# EAGLE design plugwatch (EAGLE 8.4.0)
AUTHOR: Noah Klugman; REV: B; TITLE: PlugWatch

## Sheet 1 of 4: Headers
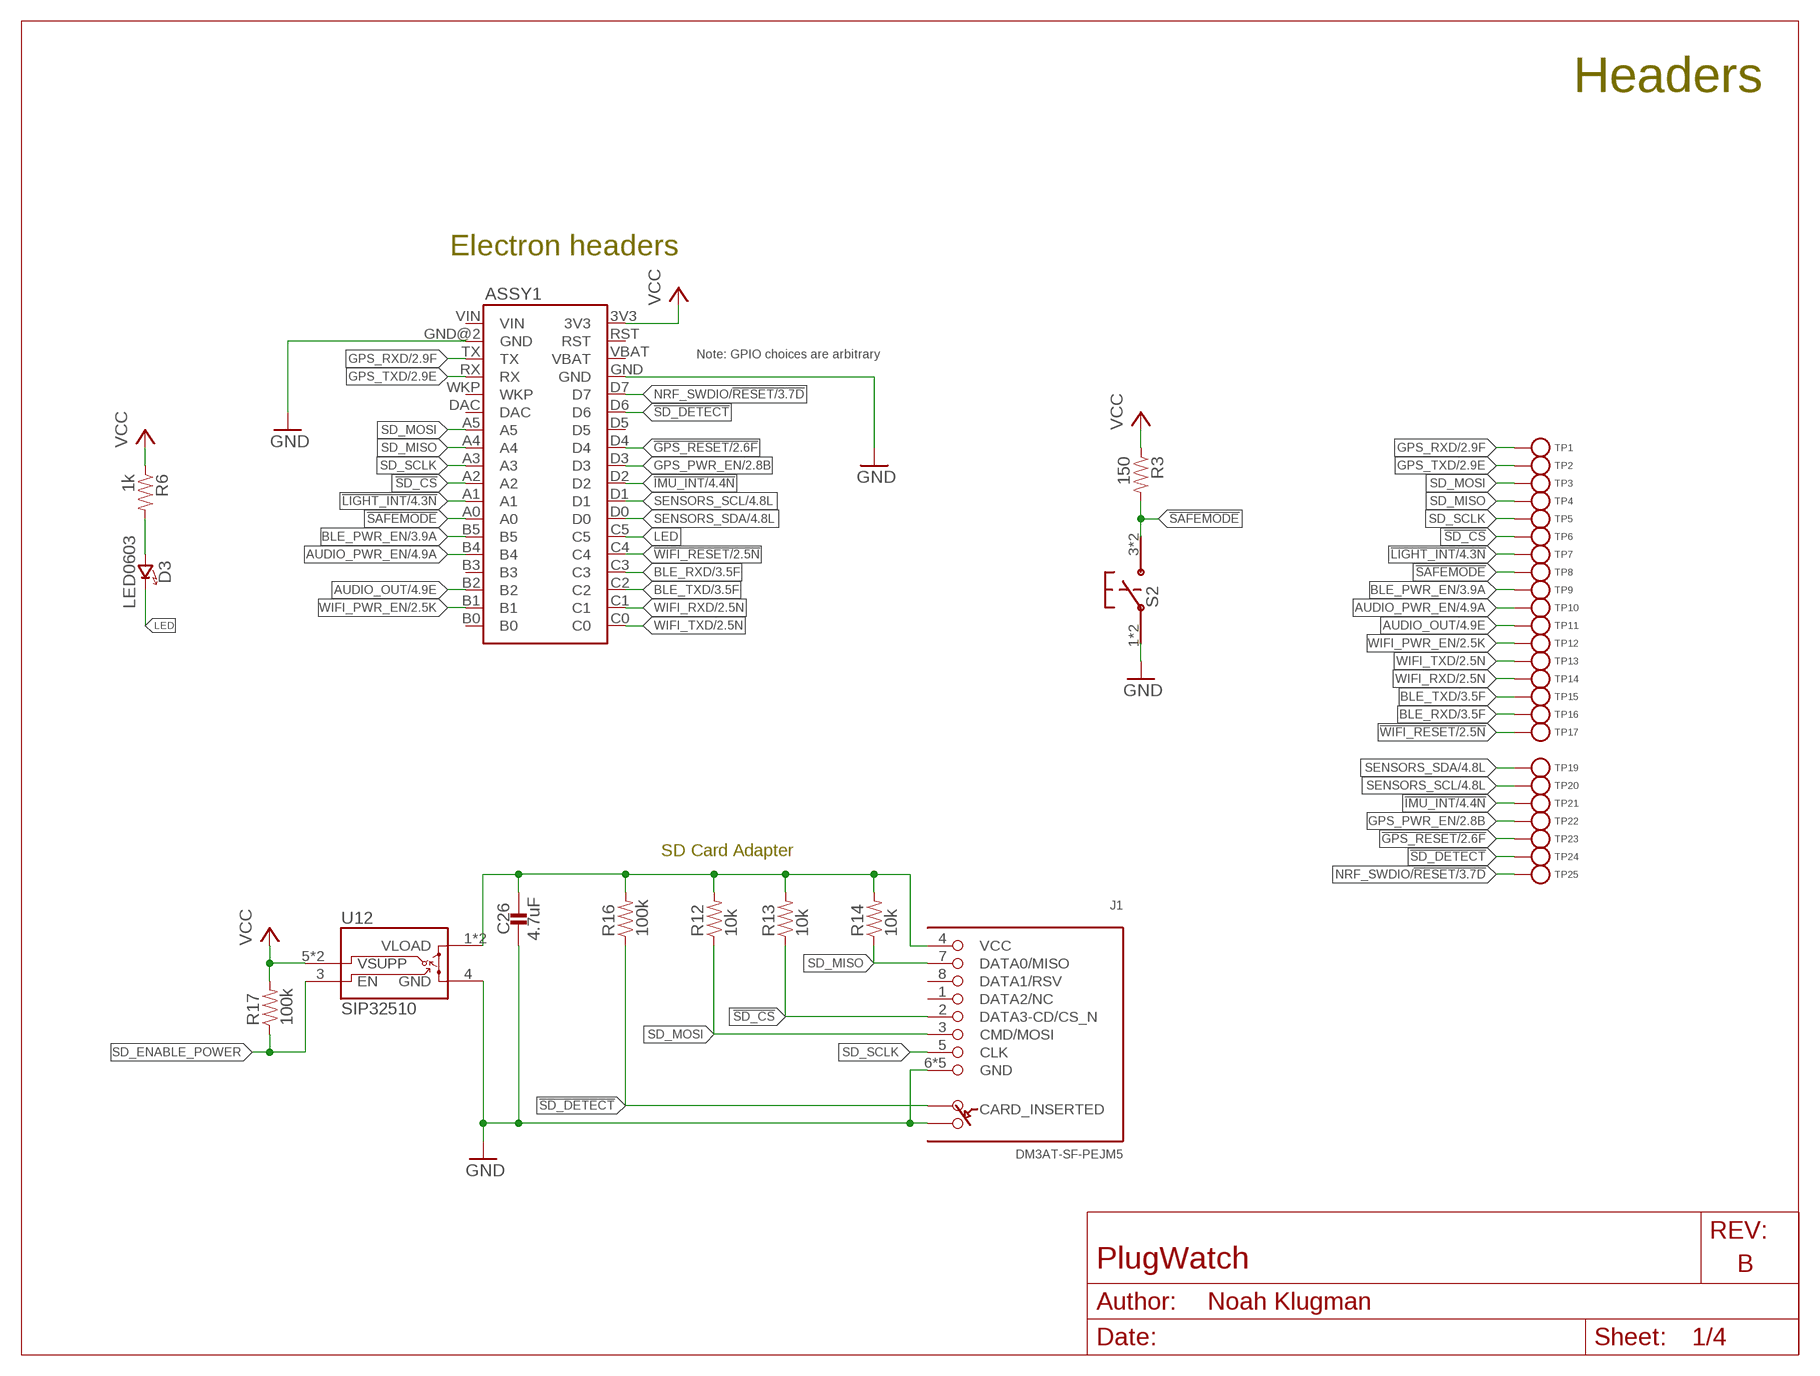
[diagram p0: schematic, sheet 1]

### Parts
ASSY1  ELECTRON  [ELECTRON_SINGLE-ROW]
C26  4.7uF  CAPACITOR0402_CAP  [0402_CAP]
D3  LED0603  [LED-0603]
J1  DM3AT-SF-PEJM5  [DM3AT-SF-PEJM5]
R3  150  RESISTOR0402_RES  [0402_RES]
R6  1k  RESISTOR0402_RES  [0402_RES]
R12  10k  RESISTOR0402_RES  [0402_RES]
R13  10k  RESISTOR0402_RES  [0402_RES]
R14  10k  RESISTOR0402_RES  [0402_RES]
R16  100k  RESISTOR0402_RES  [0402_RES]
R17  100k  RESISTOR0402_RES  [0402_RES]
S2  PTS645SM43SMTR92  [PTS645]
TP1  TEST_POINT_0.040IN  [TESTPOINT_0.040IN]
TP2  TEST_POINT_0.040IN  [TESTPOINT_0.040IN]
TP3  TEST_POINT_0.040IN  [TESTPOINT_0.040IN]
TP4  TEST_POINT_0.040IN  [TESTPOINT_0.040IN]
TP5  TEST_POINT_0.040IN  [TESTPOINT_0.040IN]
TP6  TEST_POINT_0.040IN  [TESTPOINT_0.040IN]
TP7  TEST_POINT_0.040IN  [TESTPOINT_0.040IN]
TP8  TEST_POINT_0.040IN  [TESTPOINT_0.040IN]
TP9  TEST_POINT_0.040IN  [TESTPOINT_0.040IN]
TP10  TEST_POINT_0.040IN  [TESTPOINT_0.040IN]
TP11  TEST_POINT_0.040IN  [TESTPOINT_0.040IN]
TP12  TEST_POINT_0.040IN  [TESTPOINT_0.040IN]
TP13  TEST_POINT_0.040IN  [TESTPOINT_0.040IN]
TP14  TEST_POINT_0.040IN  [TESTPOINT_0.040IN]
TP15  TEST_POINT_0.040IN  [TESTPOINT_0.040IN]
TP16  TEST_POINT_0.040IN  [TESTPOINT_0.040IN]
TP17  TEST_POINT_0.040IN  [TESTPOINT_0.040IN]
TP19  TEST_POINT_0.040IN  [TESTPOINT_0.040IN]
TP20  TEST_POINT_0.040IN  [TESTPOINT_0.040IN]
TP21  TEST_POINT_0.040IN  [TESTPOINT_0.040IN]
TP22  TEST_POINT_0.040IN  [TESTPOINT_0.040IN]
TP23  TEST_POINT_0.040IN  [TESTPOINT_0.040IN]
TP24  TEST_POINT_0.040IN  [TESTPOINT_0.040IN]
TP25  TEST_POINT_0.040IN  [TESTPOINT_0.040IN]
U12  SIP32510  [TSOT23-6]

### Nets
!GPS_RESET: ASSY1.D4 TP23.TESTPOINT ; also sheet 2
!IMU_INT: ASSY1.D2 TP21.TESTPOINT ; also sheet 4
!LIGHT_INT: ASSY1.A1 TP7.TESTPOINT ; also sheet 4
!SAFEMODE: ASSY1.A0 R3.2 S2.3 S2.4 TP8.TESTPOINT
!SD_CS: ASSY1.A2 J1.2(DATA3-CD/CS_N) R13.1 TP6.TESTPOINT
!SD_DETECT: ASSY1.D6 J1.A R16.1 TP24.TESTPOINT
!WIFI_RESET: ASSY1.C4 TP17.TESTPOINT ; also sheet 2
AUDIO_OUT: ASSY1.B2 TP11.TESTPOINT ; also sheet 4
AUDIO_PWR_EN: ASSY1.B4 TP10.TESTPOINT ; also sheet 4
BLE_PWR_EN: ASSY1.B5 TP9.TESTPOINT ; also sheet 3
BLE_RXD: ASSY1.C3 TP16.TESTPOINT ; also sheet 3
BLE_TXD: ASSY1.C2 TP15.TESTPOINT ; also sheet 3
GND: ASSY1.GND ASSY1.GND@2(GND) C26.2 J1.6(GND) J1.B J1.MOUNT0(GND) J1.MOUNT1(GND) J1.MOUNT2(GND) J1.MOUNT3(GND) S2.1 S2.2 U12.4(GND) ; also sheet 2,3,4
GPS_PWR_EN: ASSY1.D3 TP22.TESTPOINT ; also sheet 2
GPS_RXD: ASSY1.TX TP1.TESTPOINT ; also sheet 2
GPS_TXD: ASSY1.RX TP2.TESTPOINT ; also sheet 2
LED: ASSY1.C5 D3.C(CATHODE)
N$3: D3.A(ANODE) R6.2
N$18: C26.1 J1.4(VCC) R12.2 R13.2 R14.2 R16.2 U12.1(VLOAD) U12.2(VLOAD)
NRF_SWDIO/!RESET: ASSY1.D7 TP25.TESTPOINT ; also sheet 3
SD_ENABLE_POWER: R17.1 U12.3(EN)
SD_MISO: ASSY1.A4 J1.7(DATA0/MISO) R14.1 TP4.TESTPOINT
SD_MOSI: ASSY1.A5 J1.3(CMD/MOSI) R12.1 TP3.TESTPOINT
SD_SCLK: ASSY1.A3 J1.5(CLK) TP5.TESTPOINT
SENSORS_SCL: ASSY1.D1 TP20.TESTPOINT ; also sheet 4
SENSORS_SDA: ASSY1.D0 TP19.TESTPOINT ; also sheet 4
VCC: ASSY1.3V3 R3.1 R6.1 R17.2 U12.5(VSUPP) U12.6(VSUPP) ; also sheet 2,3,4
WIFI_PWR_EN: ASSY1.B1 TP12.TESTPOINT ; also sheet 2
WIFI_RXD: ASSY1.C1 TP14.TESTPOINT ; also sheet 2
WIFI_TXD: ASSY1.C0 TP13.TESTPOINT ; also sheet 2
Unconnected: ASSY1.B0 ASSY1.B3 ASSY1.D5 ASSY1.DAC ASSY1.RST ASSY1.VBAT ASSY1.WKP J1.1(DATA2/NC) J1.8(DATA1/RSV)

### Notes on the sheet
- Headers
- Electron headers
- Note: GPIO choices are arbitrary
- SD Card Adapter

## Sheet 2 of 4: GPS and WiFi Radios
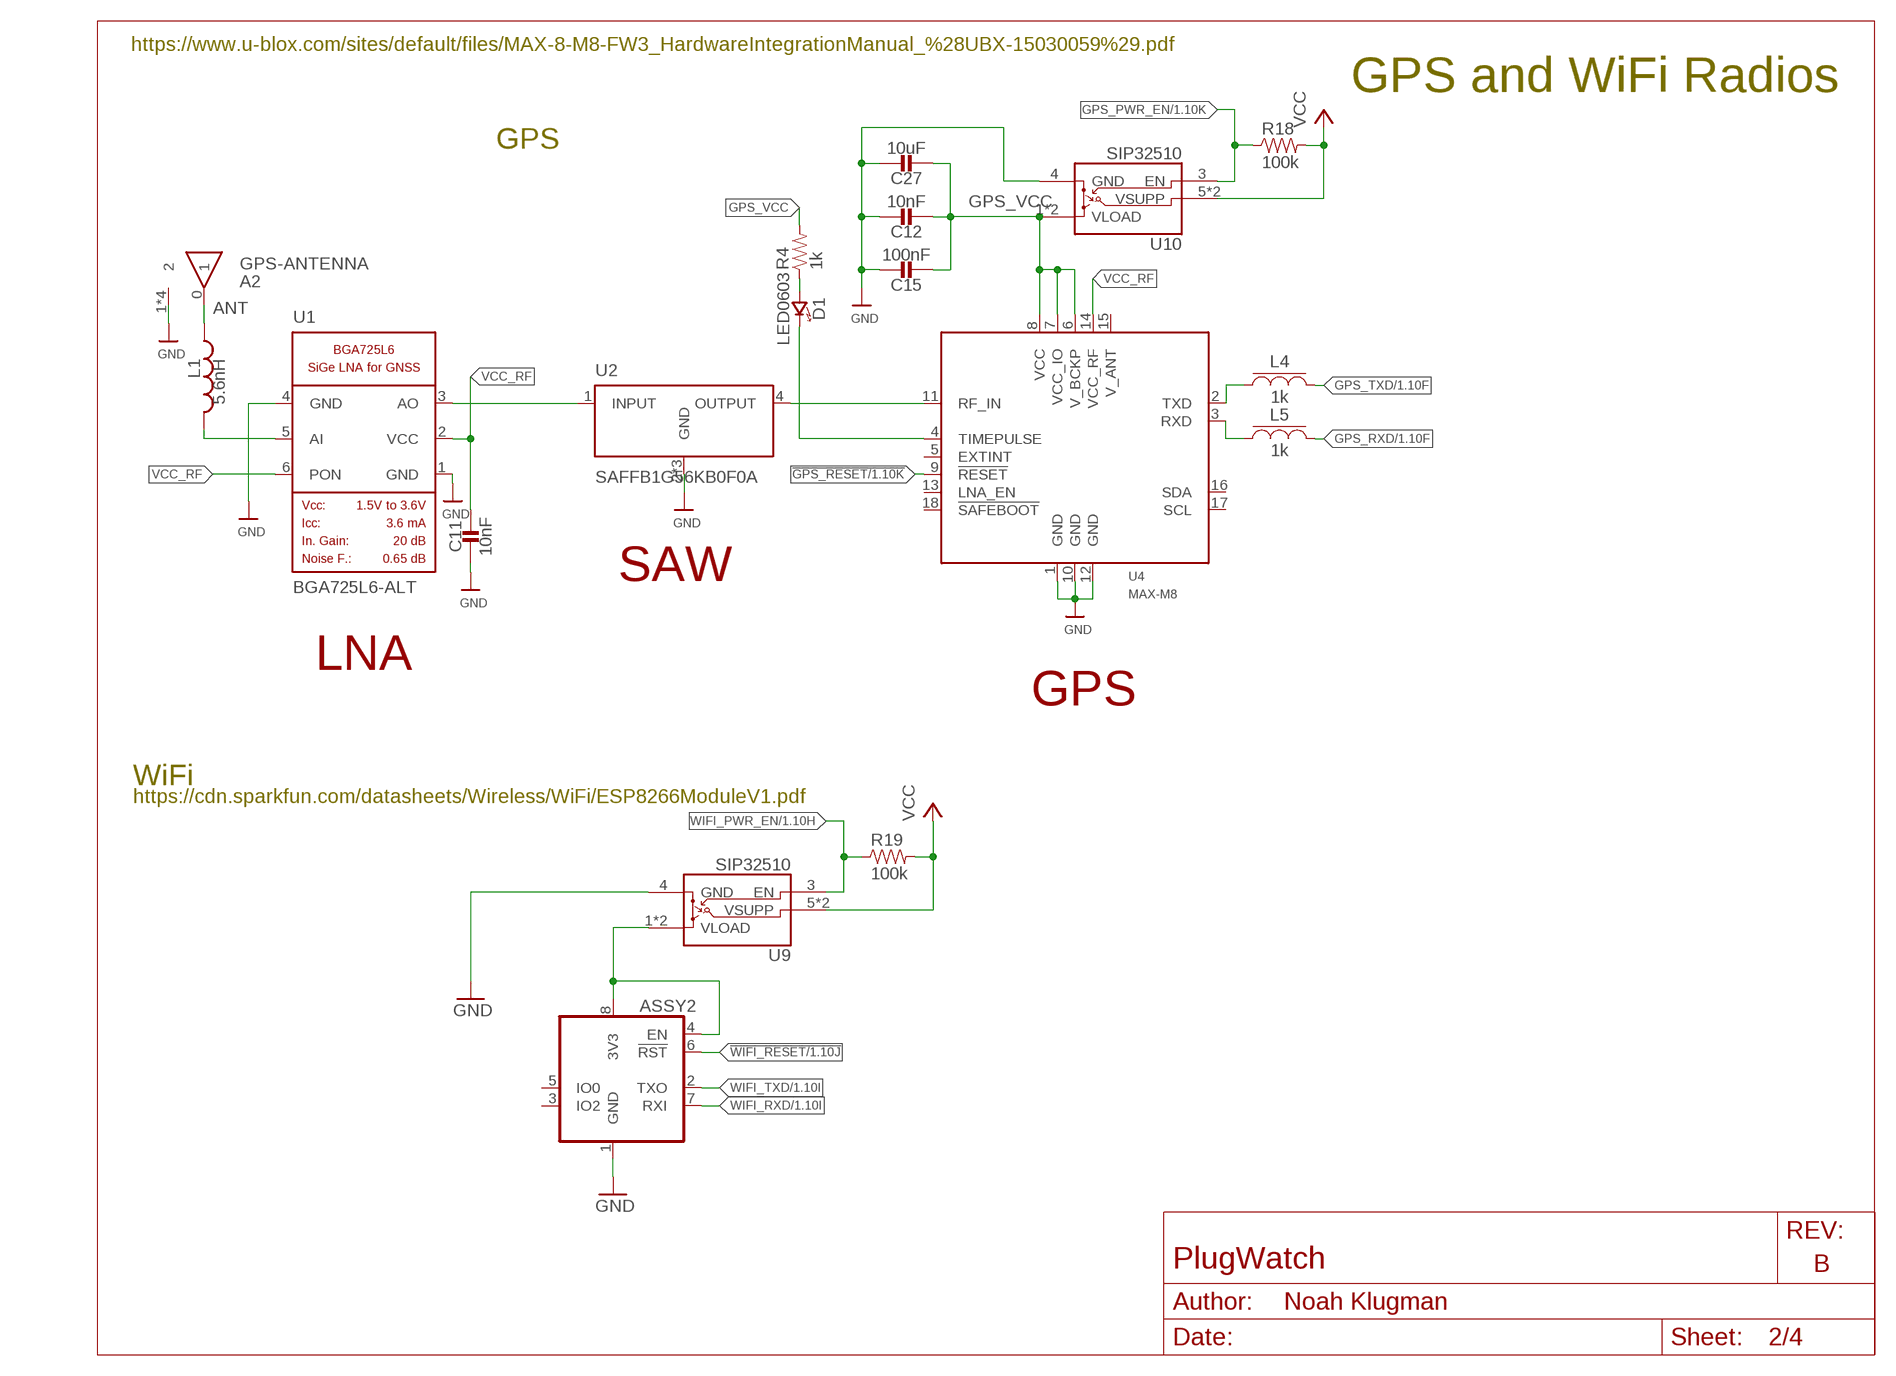
[diagram p1: schematic, sheet 2]

### Parts
A2  GPS-ANTENNA  [ANT1818B00BT1516S]
ASSY2  WRL-13678  [WRL-13678]
C11  10nF  CAPACITOR0402_CAP  [0402_CAP]
C12  10nF  CAPACITOR0402_CAP  [0402_CAP]
C15  100nF  CAPACITOR0402_CAP  [0402_CAP]
C27  10uF  CAPACITOR0402_CAP  [0402_CAP]
D1  LED0603  [LED-0603]
L1  5.6nH  INDUCTOR0402  [0402_CAP]
L4  1k  FERRITE_BEAD0402  [0402_CAP]
L5  1k  FERRITE_BEAD0402  [0402_CAP]
R4  1k  RESISTOR0402_RES  [0402_RES]
R18  100k  RESISTOR0402_RES  [0402_RES]
R19  100k  RESISTOR0402_RES  [0402_RES]
U1  BGA725L6-ALT  [LNA-TSLP-6-2-ALT]
U2  SAFFB1G56KB0F0A  FILTERS  [QCS5I]
U4  MAX-M8  [MAX-M8]
U9  SIP32510  [TSOT23-6]
U10  SIP32510  [TSOT23-6]

### Nets
!GPS_RESET: U4.9(!RESET) ; also sheet 1
!WIFI_RESET: ASSY2.6(!RST) ; also sheet 1
ANT: A2.0 L1.2
GND: A2.1 A2.2 A2.3 A2.4 ASSY2.1(GND) C11.1 C12.1 C15.1 C27.1 U1.1(GND) U1.4(GND) U2.2(GND) U2.3(GND) U2.5(GND) U4.1(GND) U4.10(GND) U4.12(GND) U9.4(GND) U10.4(GND) ; also sheet 1,3,4
GPS_PWR_EN: R18.1 U10.3(EN) ; also sheet 1
GPS_RF_IN: U2.4(OUTPUT) U4.11(RF_IN)
GPS_RXD: L5.2 ; also sheet 1
GPS_TXD: L4.2 ; also sheet 1
GPS_VCC: C12.2 C15.2 C27.2 R4.2 U4.6(V_BCKP) U4.7(VCC_IO) U4.8(VCC) U10.1(VLOAD) U10.2(VLOAD)
LNA_IN: L1.1 U1.5(AI)
LNA_OUT: U1.3(AO) U2.1(INPUT)
N$1: D1.A(ANODE) R4.1
N$2: D1.C(CATHODE) U4.4(TIMEPULSE)
N$14: ASSY2.4(EN) ASSY2.8(3V3) U9.1(VLOAD) U9.2(VLOAD)
N$40: L4.1 U4.2(TXD)
N$41: L5.1 U4.3(RXD)
VCC: R18.2 R19.2 U9.5(VSUPP) U9.6(VSUPP) U10.5(VSUPP) U10.6(VSUPP) ; also sheet 1,3,4
VCC_RF: C11.2 U1.2(VCC) U1.6(PON) U4.14(VCC_RF)
WIFI_PWR_EN: R19.1 U9.3(EN) ; also sheet 1
WIFI_RXD: ASSY2.7(RXI) ; also sheet 1
WIFI_TXD: ASSY2.2(TXO) ; also sheet 1
Unconnected: ASSY2.3(IO2) ASSY2.5(IO0) U4.5(EXTINT) U4.13(LNA_EN) U4.15(V_ANT) U4.16(SDA) U4.17(SCL) U4.18(!SAFEBOOT)

### Notes on the sheet
- https://www.u-blox.com/sites/default/files/MAX-8-M8-FW3_HardwareIntegrationManual_%28UBX-15030059%29.pdf
- GPS and WiFi Radios
- GPS
- SAW
- LNA
- GPS
- WiFi
- https://cdn.sparkfun.com/datasheets/Wireless/WiFi/ESP8266ModuleV1.pdf

## Sheet 3 of 4: BLE Radio
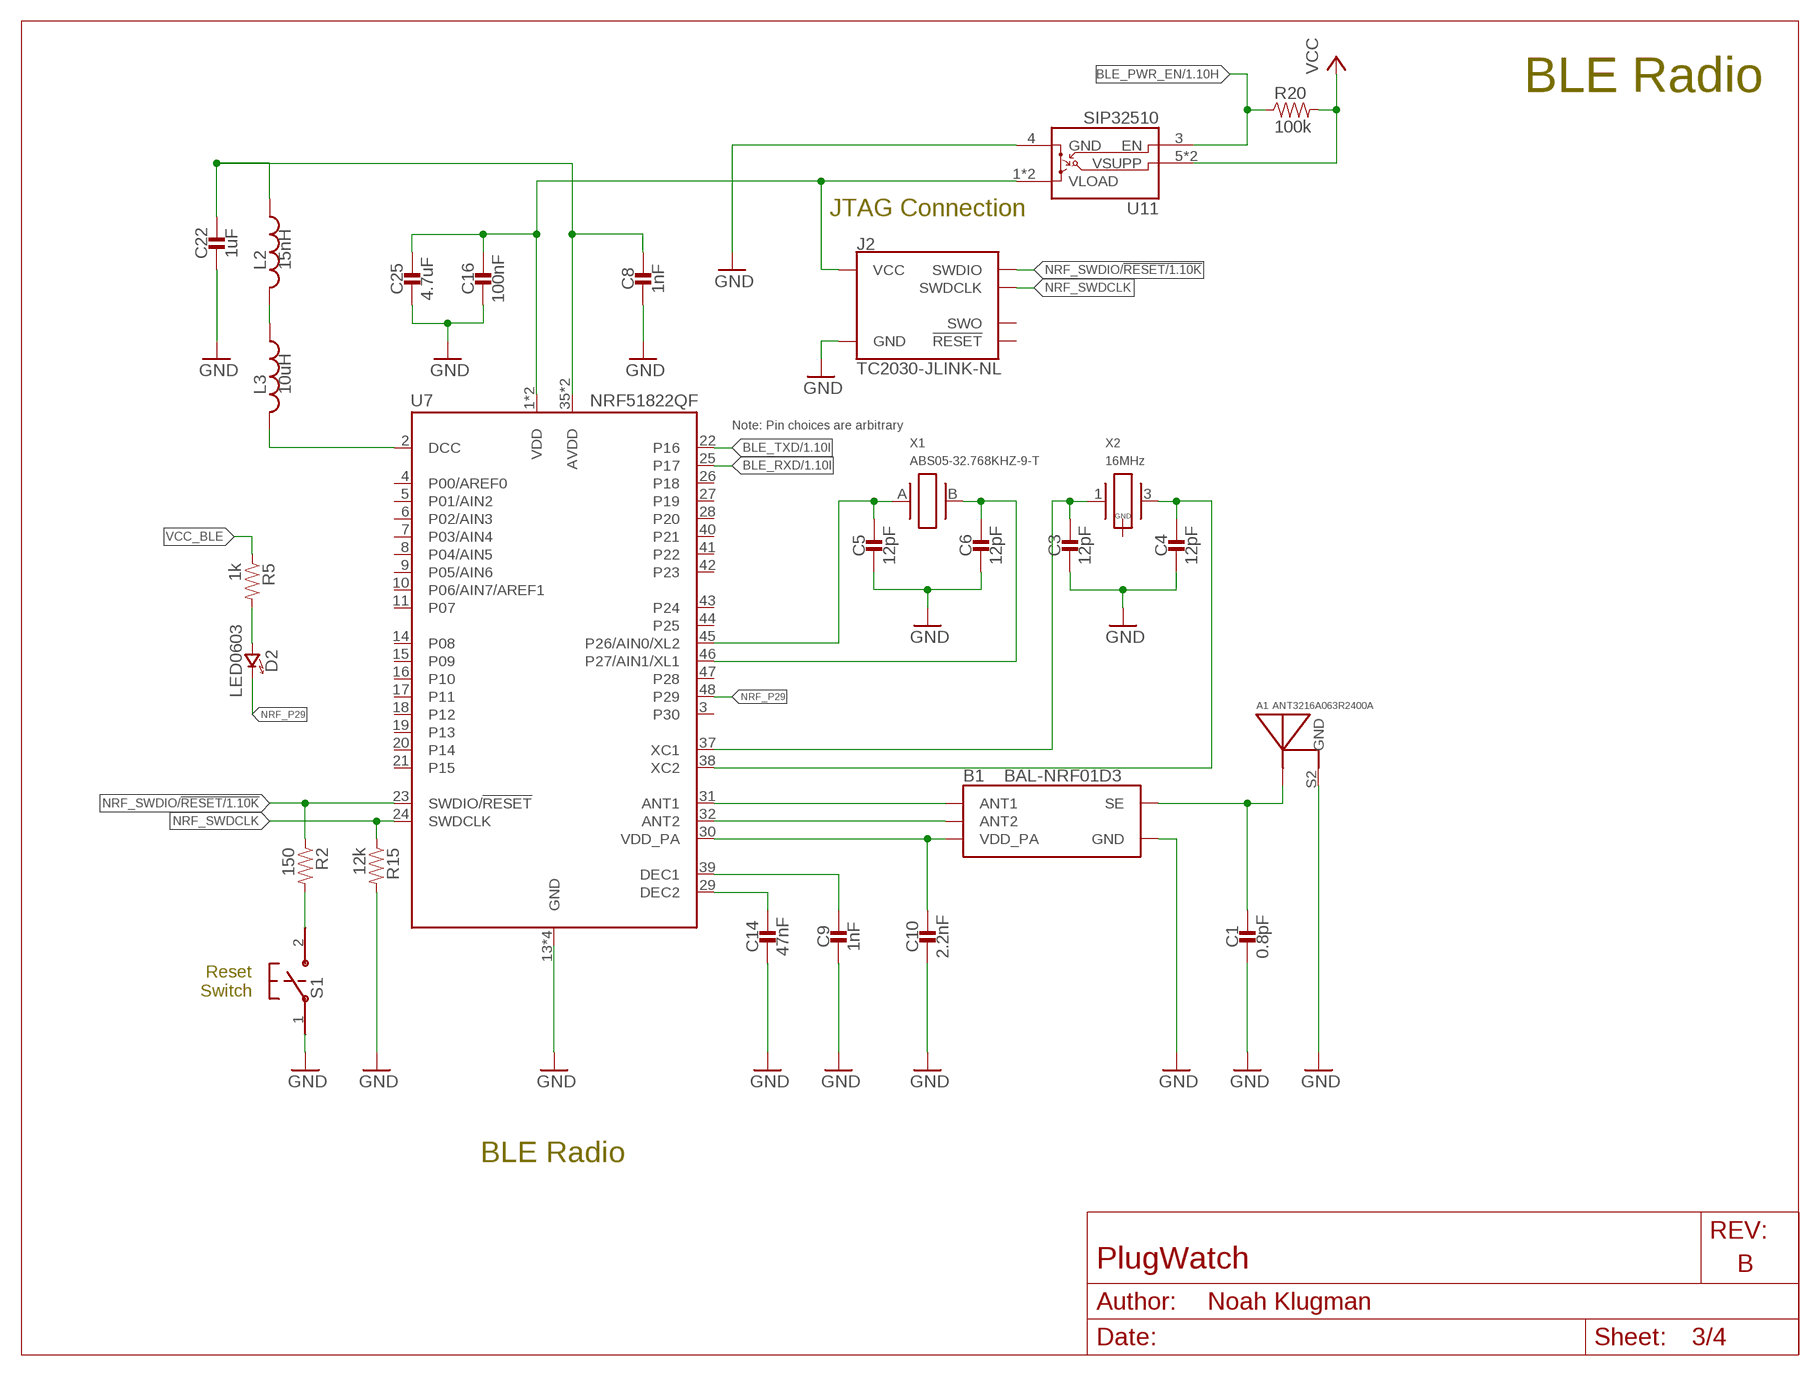
[diagram p2: schematic, sheet 3]

### Parts
A1  ANT3216A063R2400A  [ANT3216A063R2400A]
B1  BAL-NRF01D3  [BAL-NRF01D3]
C1  0.8pF  CAPACITOR0402_CAP  [0402_CAP]
C3  12pF  CAPACITOR0402_CAP  [0402_CAP]
C4  12pF  CAPACITOR0402_CAP  [0402_CAP]
C5  12pF  CAPACITOR0402_CAP  [0402_CAP]
C6  12pF  CAPACITOR0402_CAP  [0402_CAP]
C8  1nF  CAPACITOR0402_CAP  [0402_CAP]
C9  1nF  CAPACITOR0402_CAP  [0402_CAP]
C10  2.2nF  CAPACITOR0402_CAP  [0402_CAP]
C14  47nF  CAPACITOR0402_CAP  [0402_CAP]
C16  100nF  CAPACITOR0402_CAP  [0402_CAP]
C22  1uF  CAPACITOR0402_CAP  [0402_CAP]
C25  4.7uF  CAPACITOR0402_CAP  [0402_CAP]
D2  LED0603  [LED-0603]
J2  TC2030-JLINK-NL  [TC2030-IDC-NL]
L2  15nH  INDUCTOR0402  [0402_CAP]
L3  10uH  INDUCTOR0603  [0603_CAP]
R2  150  RESISTOR0402_RES  [0402_RES]
R5  1k  RESISTOR0402_RES  [0402_RES]
R15  12k  RESISTOR0402_RES  [0402_RES]
R20  100k  RESISTOR0402_RES  [0402_RES]
S1  B3U-1000P  [B3U-1000P]
U7  NRF51822QF  [QFN-48-6MM]
U11  SIP32510  [TSOT23-6]
X1  ABS05-32.768KHZ-9-T  [ABS05]
X2  16MHz  TXC-8Y  [TXC-8Y]

### Nets
AVDD1: C8.1 C22.1 L2.1 U7.35(AVDD) U7.36(AVDD)
BLE_PWR_EN: R20.1 U11.3(EN) ; also sheet 1
BLE_RXD: U7.25(P17) ; also sheet 1
BLE_TXD: U7.22(P16) ; also sheet 1
DCC1: L3.2 U7.2(DCC)
GND: A1.S2(GND) B1.GND C1.2 C3.2 C4.2 C5.2 C6.2 C8.2 C9.2 C10.2 C14.2 C16.2 C22.2 C25.2 J2.5(GND) R15.2 S1.1 U7.13(GND) U7.33(GND) U7.34(GND) U7.GND U11.4(GND) ; also sheet 1,2,4
N$10: B1.ANT1 U7.31(ANT1)
N$12: B1.ANT2 U7.32(ANT2)
N$13: A1.S1(ANTENNA) B1.SE C1.1
N$15: L2.2 L3.1
N$20: C3.1 U7.37(XC1) X2.1
N$21: C4.1 U7.38(XC2) X2.3
N$22: C9.1 U7.39(DEC1)
N$24: C14.1 U7.29(DEC2)
N$25: D2.A(ANODE) R5.2
N$26: R2.2 S1.2
NRF_A2: C6.1 U7.46(P27/AIN1/XL1) X1.B
NRF_A3: C5.1 U7.45(P26/AIN0/XL2) X1.A
NRF_P29: D2.C(CATHODE) U7.48(P29)
NRF_SWDCLK: J2.4(SWDCLK) R15.1 U7.24(SWDCLK)
NRF_SWDIO/!RESET: J2.2(SWDIO) R2.1 U7.23(SWDIO/!RESET) ; also sheet 1
VCC: R20.2 U11.5(VSUPP) U11.6(VSUPP) ; also sheet 1,2,4
VCC_BLE: C16.1 C25.1 J2.1(VCC) R5.1 U7.1(VDD) U7.12(VDD) U11.1(VLOAD) U11.2(VLOAD)
VDD_PA1: B1.VCC(VDD_PA) C10.1 U7.30(VDD_PA)
Unconnected: J2.3(!RESET) J2.6(SWO) U7.3(P30) U7.4(P00/AREF0) U7.5(P01/AIN2) U7.6(P02/AIN3) U7.7(P03/AIN4) U7.8(P04/AIN5) U7.9(P05/AIN6) U7.10(P06/AIN7/AREF1) U7.11(P07) U7.14(P08) U7.15(P09) U7.16(P10) U7.17(P11) U7.18(P12) U7.19(P13) U7.20(P14) U7.21(P15) U7.26(P18) U7.27(P19) U7.28(P20) U7.40(P21) U7.41(P22) U7.42(P23) U7.43(P24) U7.44(P25) U7.47(P28) X2.2(GND) X2.4(GND)

### Notes on the sheet
- BLE Radio
- JTAG Connection
- Note: Pin choices are arbitrary
- Reset
  Switch
- BLE Radio

## Sheet 4 of 4: Sensors
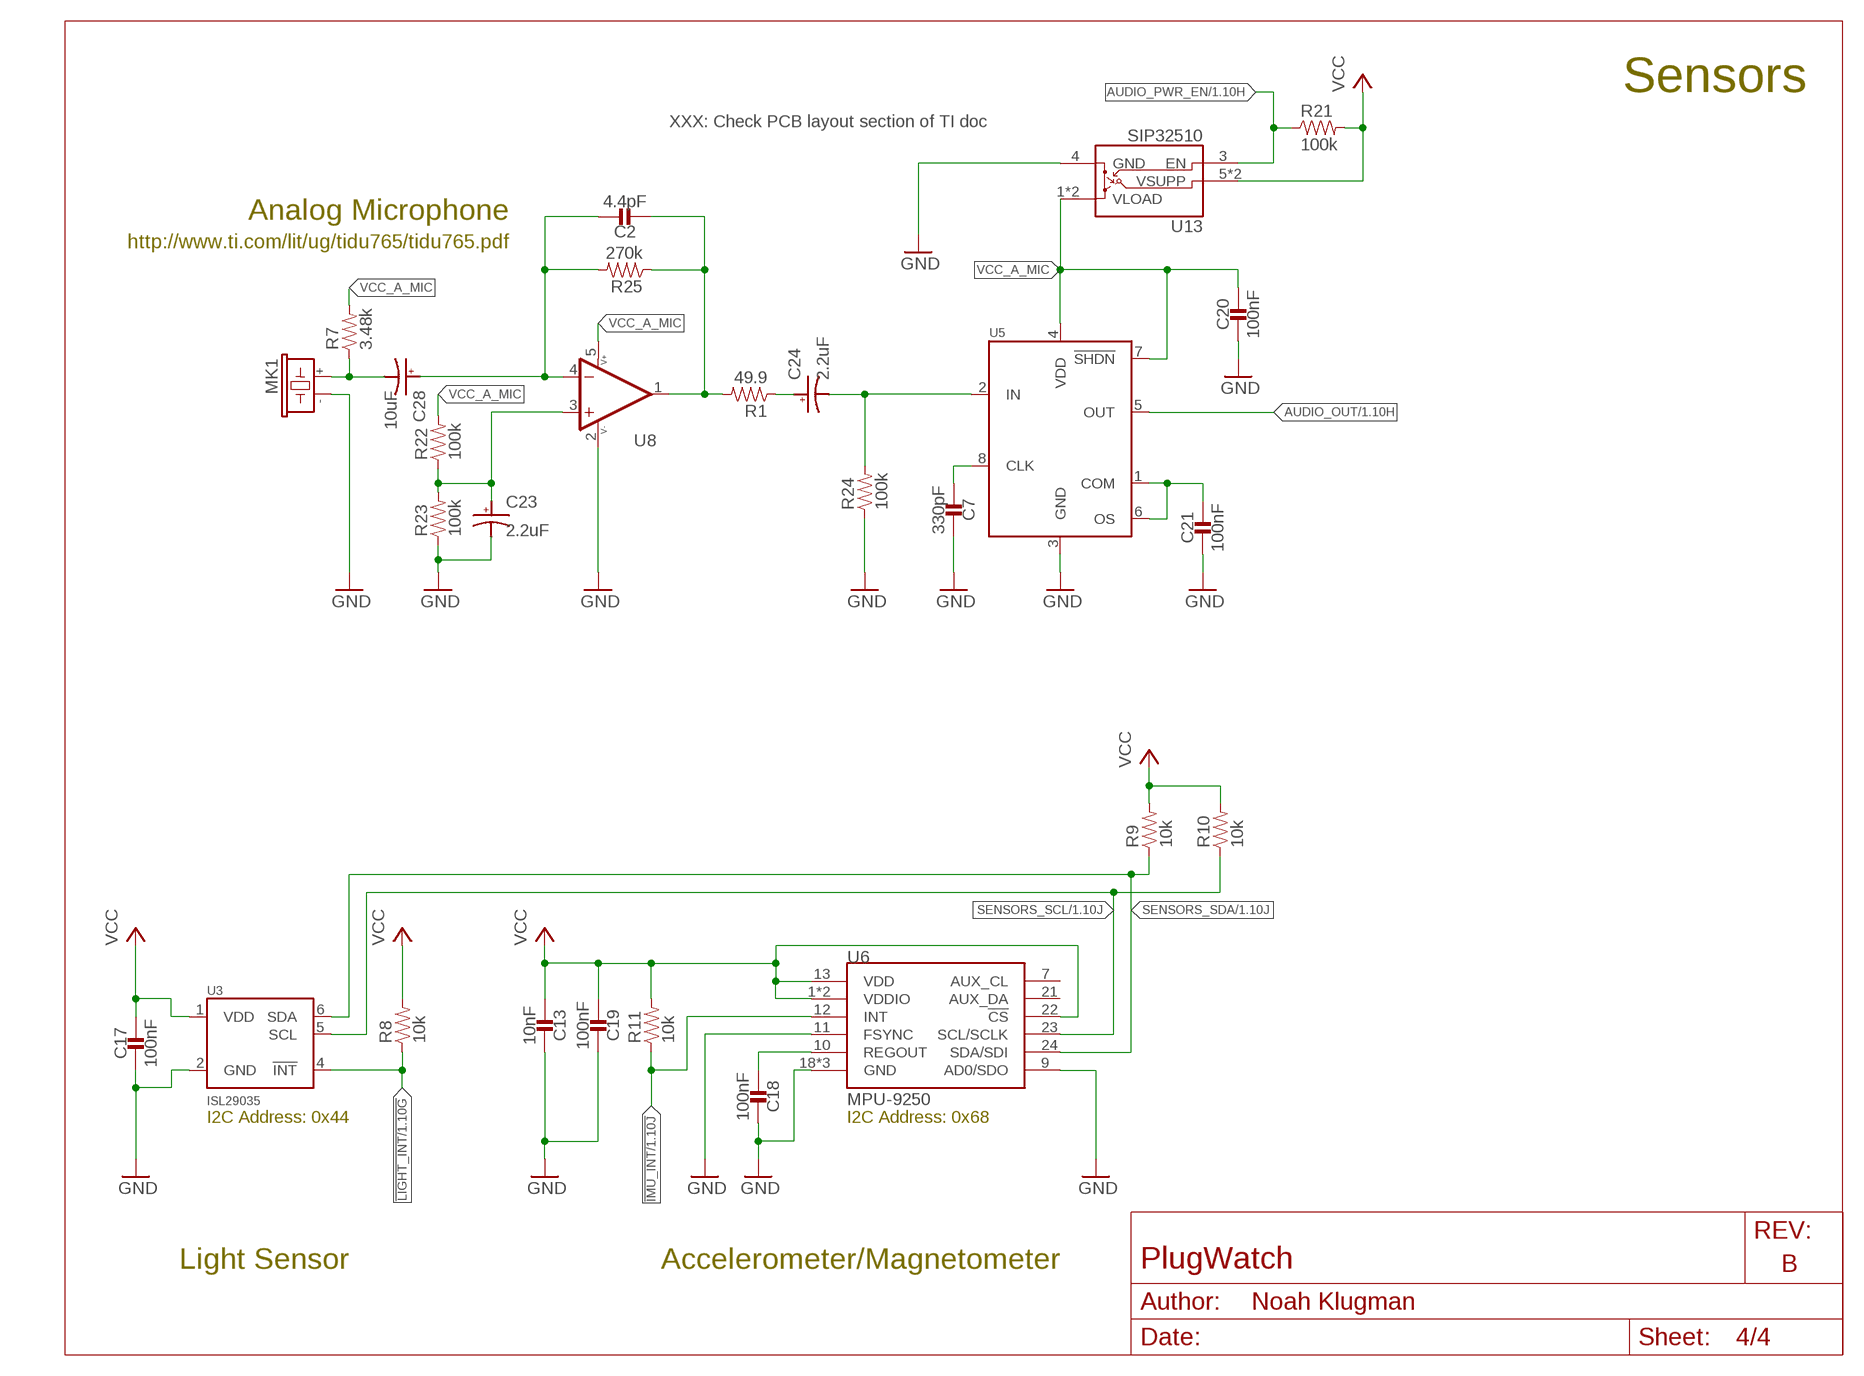
[diagram p3: schematic, sheet 4]

### Parts
C2  4.4pF  CAPACITOR0603_CAP  [0603_CAP]
C7  330pF  CAPACITOR0402_CAP  [0402_CAP]
C13  10nF  CAPACITOR0402_CAP  [0402_CAP]
C17  100nF  CAPACITOR0402_CAP  [0402_CAP]
C18  100nF  CAPACITOR0402_CAP  [0402_CAP]
C19  100nF  CAPACITOR0402_CAP  [0402_CAP]
C20  100nF  CAPACITOR0402_CAP  [0402_CAP]
C21  100nF  CAPACITOR0402_CAP  [0402_CAP]
C23  2.2uF  CAP_POL1206  [1206]
C24  2.2uF  CAP_POL1206  [1206]
C28  10uF  CAP_POL1206  [1206]
MK1  AOM-4546P-R  [MIC_AOM-4546P-R]
R1  49.9  RESISTOR0603_RES  [0603-RES]
R7  3.48k  RESISTOR0603_RES  [0603-RES]
R8  10k  RESISTOR0402_RES  [0402_RES]
R9  10k  RESISTOR0402_RES  [0402_RES]
R10  10k  RESISTOR0402_RES  [0402_RES]
R11  10k  RESISTOR0402_RES  [0402_RES]
R21  100k  RESISTOR0402_RES  [0402_RES]
R22  100k  RESISTOR0603_RES  [0603-RES]
R23  100k  RESISTOR0603_RES  [0603-RES]
R24  100k  RESISTOR0603_RES  [0603-RES]
R25  270k  RESISTOR0603_RES  [0603-RES]
U3  ISL29035  [ODFN-6-1.5MMX1.6MM]
U5  MAX740XESA  [SOIC-8]
U6  MPU-9250  [QFN24_PAD]
U8  OPA322AIDBVT  [SOT23-5]
U13  SIP32510  [TSOT23-6]

### Nets
!IMU_INT: R11.1 U6.12(INT) ; also sheet 1
!LIGHT_INT: R8.1 U3.4(!INT) ; also sheet 1
-AMP: C2.1 C28.2(CATHODE) R25.2 U8.4(-IN)
A_MIC_OUT: C24.1(ANODE) R24.2 U5.2(IN)
AUDIO_OUT: U5.5(OUT) ; also sheet 1
AUDIO_PWR_EN: R21.1 U13.3(EN) ; also sheet 1
GND: C7.1 C13.2 C17.2 C18.2 C19.2 C20.2 C21.2 C23.1(ANODE) MK1.TERM- R23.1 R24.1 U3.2(GND) U5.3(GND) U6.9(AD0/SDO) U6.11(FSYNC) U6.18(GND) U6.20(GND) U6.CENTER(GND) U8.2(V-) U13.4(GND) ; also sheet 1,2,3
N$4: C28.1(ANODE) MK1.TERM+ R7.1
N$5: C2.2 R1.2 R25.1 U8.1(OUT)
N$6: C7.2 U5.8(CLK)
N$7: C24.2(CATHODE) R1.1
N$9: C23.2(CATHODE) R22.1 R23.2 U8.3(+IN)
N$11: C21.1 U5.1(COM) U5.6(OS)
REGOUT: C18.1 U6.10(REGOUT)
SENSORS_SCL: R10.1 U3.5(SCL) U6.23(SCL/SCLK) ; also sheet 1
SENSORS_SDA: R9.1 U3.6(SDA) U6.24(SDA/SDI) ; also sheet 1
VCC: C13.1 C17.1 C19.1 R8.2 R9.2 R10.2 R11.2 R21.2 U3.1(VDD) U6.1(VDDIO) U6.8(VDDIO) U6.13(VDD) U6.22(!CS) U13.5(VSUPP) U13.6(VSUPP) ; also sheet 1,2,3
VCC_A_MIC: C20.1 R7.2 R22.2 U5.4(VDD) U5.7(!SHDN) U8.5(V+) U13.1(VLOAD) U13.2(VLOAD)
Unconnected: U6.7(AUX_CL) U6.21(AUX_DA)

### Notes on the sheet
- Sensors
- XXX: Check PCB layout section of TI doc
- Analog Microphone
- http://www.ti.com/lit/ug/tidu765/tidu765.pdf
- I2C Address: 0x44 | I2C Address: 0x68
- Light Sensor | Accelerometer/Magnetometer

## Power pins joined to a net without a drawn wire
VIN: ASSY1.VIN

## Library data of the parts
A1 = chips:ANT3216A063R2400A: Yageo 2.4GHz WiFi/Bluetooth/Zigbee/ISM Chip Antenna; DIGIKEY: 311-1542-1-ND; MANUFACTURER: YAGEO; MPN: ANT3216A063R2400A
A2 = antenna:GPS-ANTENNA; DIGIKEY: 311-1531-ND
ASSY1 = electron:ELECTRON; DIGIKEY: S7051-ND,S7051-ND
ASSY2 = chips:WRL-13678: ESP8266 WiFi Module https://www.mouser.com/ds/2/813/ESP8266ModuleV1-1095236.pdf; DIGIKEY: 1568-1235-ND
B1 = chips:BAL-NRF01D3: 50 ohm nominal input / conjugate match balun to nRF51422-QFAA, nRF24LE1, nRF51822-QFAA/AB, with integrated harmonic filter; DIGIKEY: 497-13637-1-ND; MANUFACTURER: STMicroelectronics; MOUSER: 511-BAL-NRF01D3; MPN: BAL-NRF01D3
C1 = passives:CAPACITOR: 0402 Capacitor; DIGIKEY: 490-6269-1-ND
C2 = passives:CAPACITOR: 0402 Capacitor; DIGIKEY: 399-16187-1-ND
C3-C6 = passives:CAPACITOR: 0402 Capacitor; DIGIKEY: 490-6197-1-ND
C7 = passives:CAPACITOR: 0402 Capacitor; DIGIKEY: 490-6233-1-ND
C8 C9 = passives:CAPACITOR: 0402 Capacitor; DIGIKEY: 490-6366-1-ND
C10 = passives:CAPACITOR: 0402 Capacitor; DIGIKEY: 490-5419-1-ND
C11-C13 = passives:CAPACITOR: 0402 Capacitor; DIGIKEY: 490-7763-1-ND
C14 = passives:CAPACITOR: 0402 Capacitor; DIGIKEY: 490-11420-1-ND
C15-C21 = passives:CAPACITOR: 0402 Capacitor; DIGIKEY: 490-10777-1-ND
C22 = passives:CAPACITOR: 0402 Capacitor; DIGIKEY: 490-14457-1-ND
C23 C24 = passives:CAP_POL; DIGIKEY: 718-1131-1-ND
C25 C26 = passives:CAPACITOR: 0402 Capacitor; DIGIKEY: 445-5947-1-ND
C27 = passives:CAPACITOR: 0402 Capacitor; DIGIKEY: 490-8316-1-ND
C28 = passives:CAP_POL; DIGIKEY: 478-8481-1-ND
D1-D3 = leds:LED: LED; DIGIKEY: 160-1837-6-ND
J1 = connector:DM3AT-SF-PEJM5: CONN MICRO SD R/A PUSH-PUSH SMD; DIGIKEY: HR1964CT-ND
J2 = connector:TC2030-JLINK
L1 = passives:INDUCTOR: A very specific inductor; DIGIKEY: 490-11766-1-ND
L2 = passives:INDUCTOR: A very specific inductor; DIGIKEY: 587-1521-1-ND
L3 = passives:INDUCTOR: A very specific inductor; DIGIKEY: 490-4025-1-ND
L4 L5 = passives:FERRITE_BEAD; DIGIKEY: 490-4003-1-ND
MK1 = microphones:AOM-4546P-R: Electret microphone; DIGIKEY: 668-1224-ND
R1 = passives:RESISTOR: Resistor Basic schematic elements and footprints for 0603, 1206, and PTH resistors.; DIGIKEY: 541-3003-1-ND
R2 R3 = passives:RESISTOR: Resistor Basic schematic elements and footprints for 0603, 1206, and PTH resistors.; DIGIKEY: RMCF0402FT150RCT-ND
R4-R6 = passives:RESISTOR: Resistor Basic schematic elements and footprints for 0603, 1206, and PTH resistors.; DIGIKEY: RMCF0402FT1K00CT-ND
R7 = passives:RESISTOR: Resistor Basic schematic elements and footprints for 0603, 1206, and PTH resistors.; DIGIKEY: 541-3.48KHCT-ND
R8-R14 = passives:RESISTOR: Resistor Basic schematic elements and footprints for 0603, 1206, and PTH resistors.; DIGIKEY: RMCF0402FT10K0CT-ND
R15 = passives:RESISTOR: Resistor Basic schematic elements and footprints for 0603, 1206, and PTH resistors.; DIGIKEY: RMCF0402FT12K0CT-ND
R16-R21 = passives:RESISTOR: Resistor Basic schematic elements and footprints for 0603, 1206, and PTH resistors.; DIGIKEY: 1276-3432-1-ND
R22-R24 = passives:RESISTOR: Resistor Basic schematic elements and footprints for 0603, 1206, and PTH resistors.; DIGIKEY: 541-2972-1-ND
R25 = passives:RESISTOR: Resistor Basic schematic elements and footprints for 0603, 1206, and PTH resistors.; DIGIKEY: 541-270KHCT-ND
S1 = switches:B3U: Switch; DIGIKEY: SW1020CT-ND; MANUFACTURER: Omron; MPN: B3U-1000P
S2 = switches:PTS645SM43SMTR92: Tactile Switch SPST-NO Top Actuated Surface Mount; DIGIKEY: CKN9112CT-ND
TP1-TP17 TP19-TP25 = headers:TEST_POINT_0.040IN: 0.040in Test Point; DIGIKEY: 5001K-ND
U1 = Particle:BGA725L6; DIGIKEY: BGA725L6E6327FTSA1CT-ND
U2 = Particle:FILTERS; ABACUS_TECHNOLOGIES: SAFFB1G56KB0F0A
U3 = chips:ISL29035: Optical Sensor Ambient 550nm I2C; DIGIKEY: ISL29035IROZ-T7CT-ND; MPN: ISL29035IROZ-T7
U4 = u-blox:MAX-M8; DIGIKEY: 672-1003-1-ND
U5 = chips:MAX740X; ROCHESTER_ELECTRONICS: MAX7405ESA
U6 = Testing:MPU-9250: NC pin 19. 2-6 & 14-17 not internally connected. May be used for PCB trace routing.; DIGIKEY: 1428-1019-1-ND; PROD_ID: IC-13192
U7 = chips:NRF51822: Multiprotocol Bluetooth® 4.0 low energy/2.4 GHz RF SoC; DIGIKEY: 1490-1049-1-ND; MANUFACTURER: Nordic Semi; MOUSER: 949-NRF51822-QFAC-R7; MPN: NRF51822-QFAC-R7
U8 = opamps:OPA322; DIGIKEY: 296-29511-1-ND
U9-U13 = chips:SIP32510: Load switch, slew rate controlled. By Vishay; DIGIKEY: SIP32510DT-T1-GE3CT-ND; MANUFACTURER: Vishay; MPN: SIP32510DT-T1-GE3
X1 = crystals:ABS05-32.768KHZ: 32.768kHz Crystal; DIGIKEY: 535-11897-1-ND
X2 = crystals:TXC-8Y: 2mmx1.6mm SMD Crystal; DIGIKEY: 887-2003-1-ND

## Board
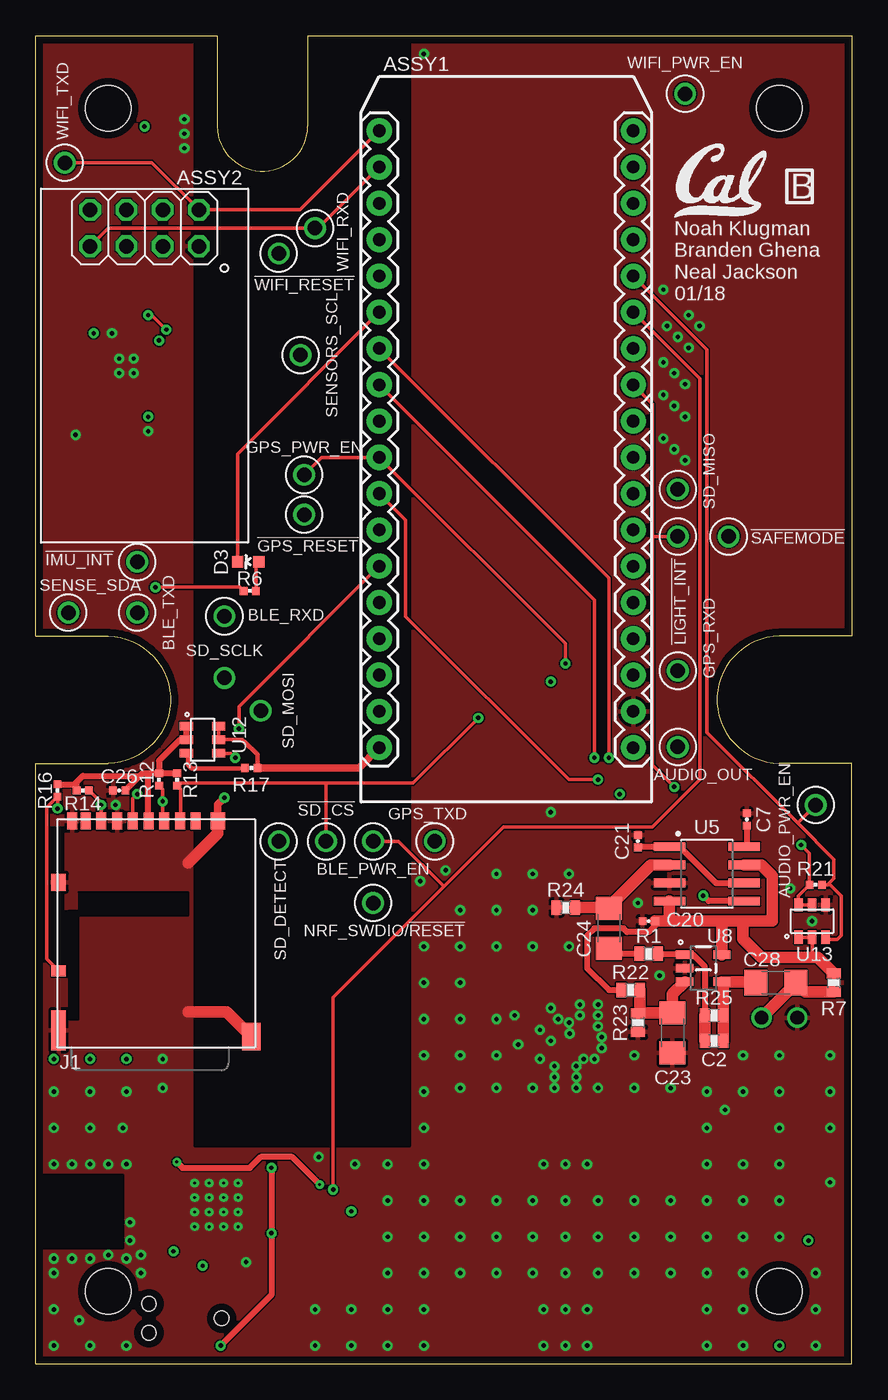
[diagram p4: board, top side]
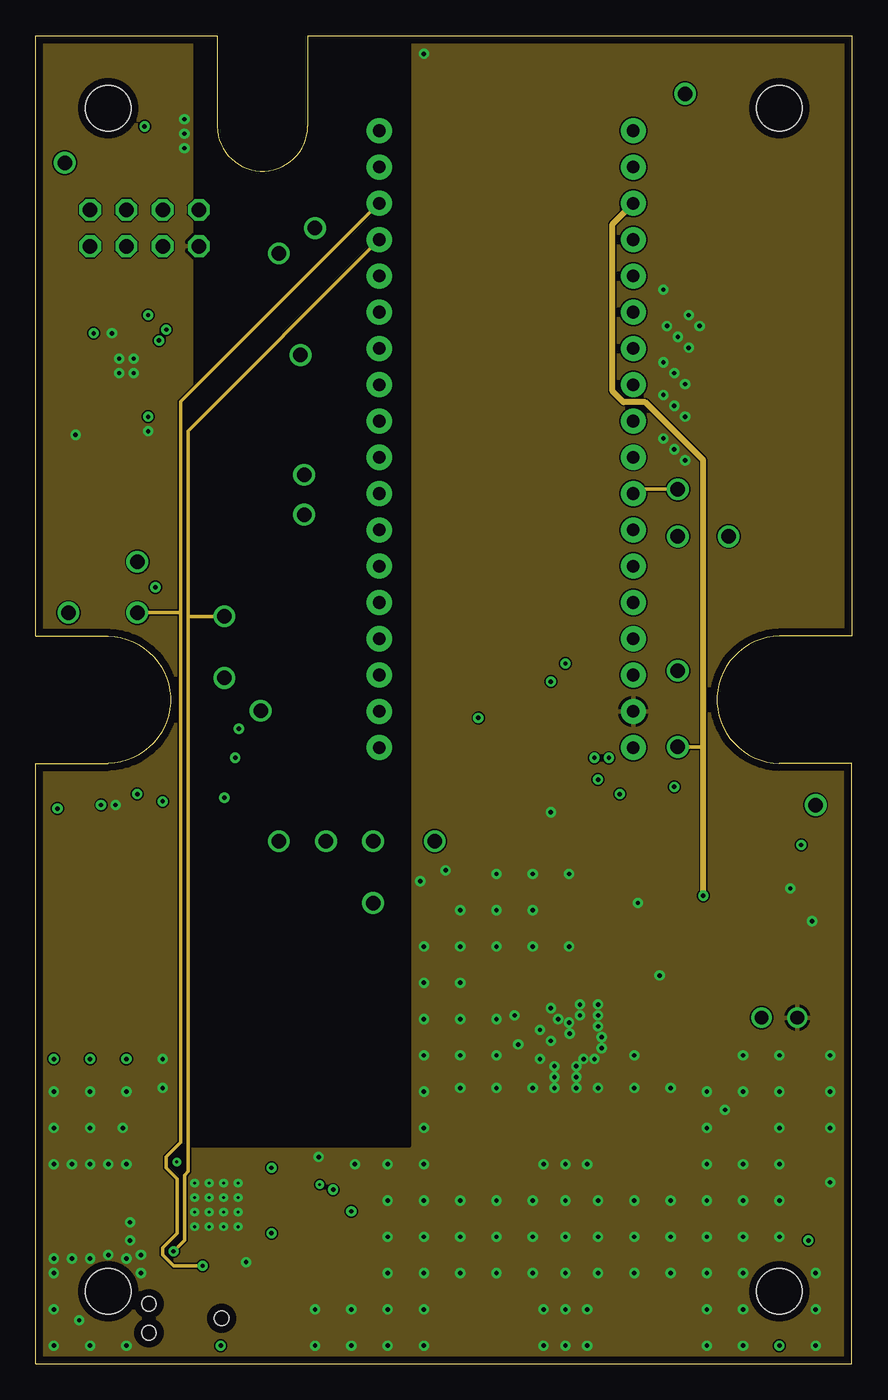
[diagram p5: board, inner layer Route2]
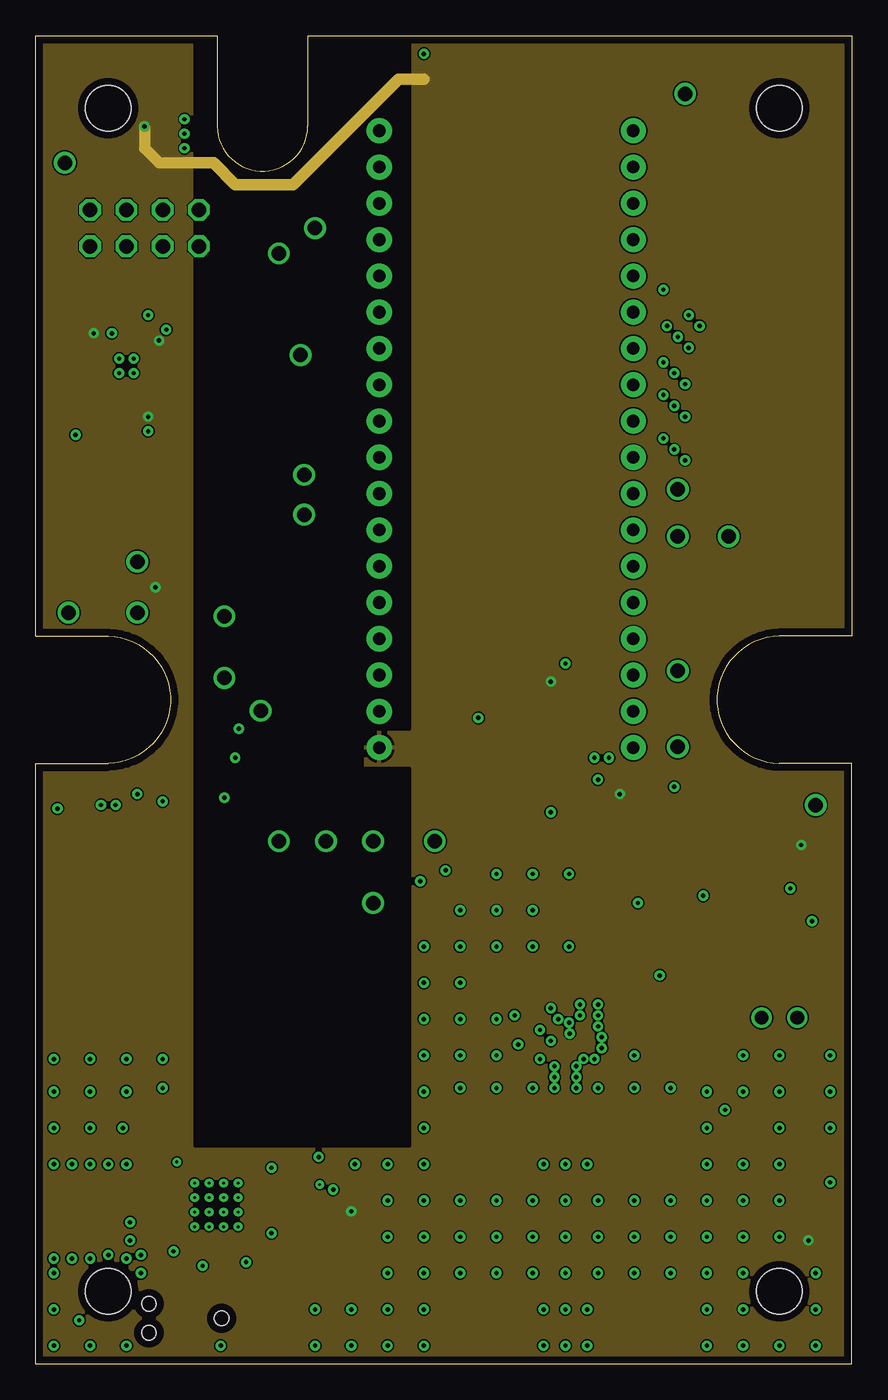
[diagram p6: board, inner layer Route15]
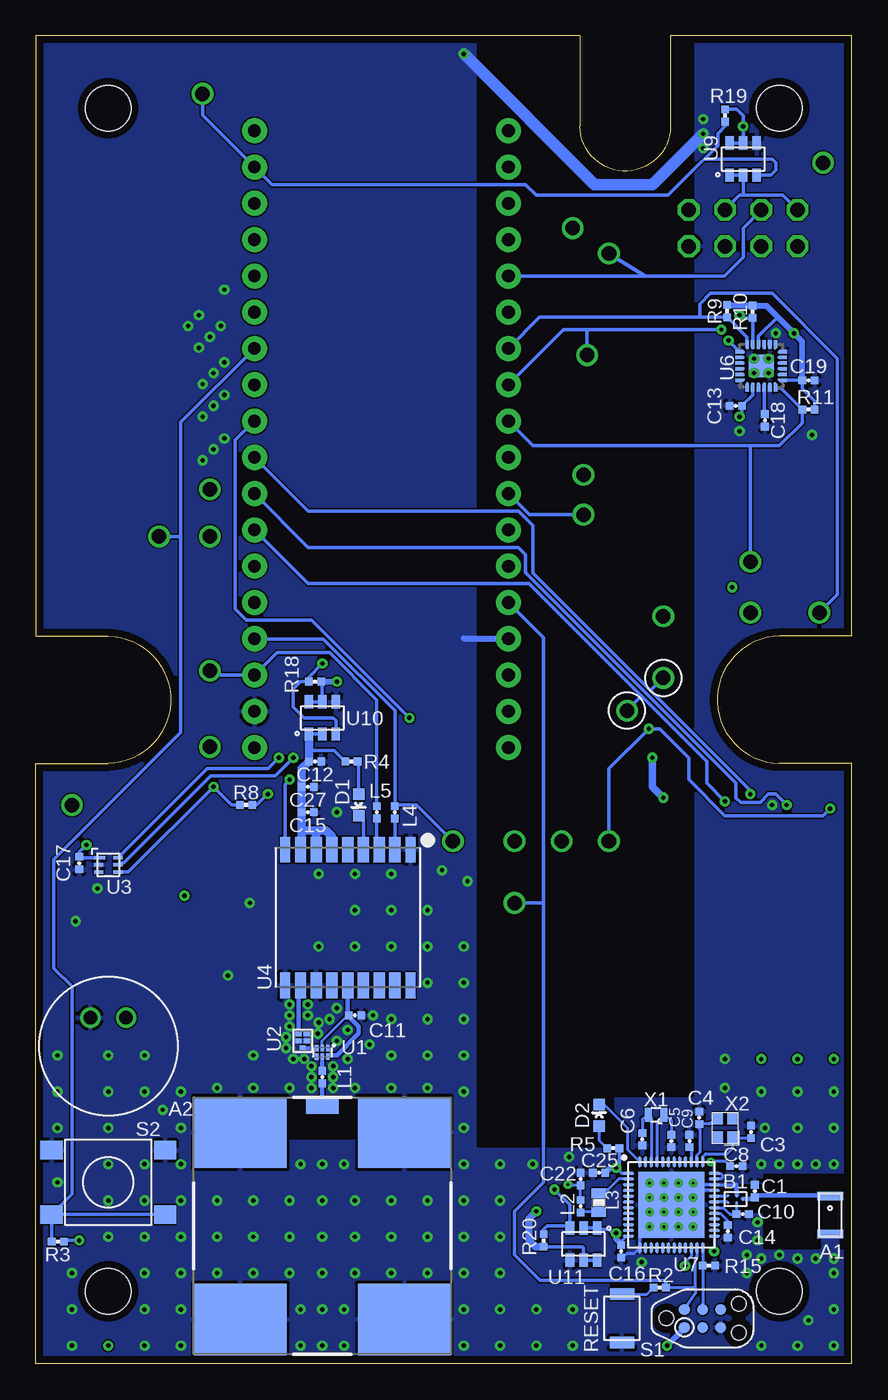
[diagram p7: board, bottom side, seen from below]

Size 57.15 x 92.96 mm. Coordinates in mm from the lower left corner, seen from the top.
Outline: 0,0 0,42.04 5.08,42.04 arc178 5.08,50.93 0,50.93 0,92.96 12.7,92.96 12.7,86.61 arc178 19.05,86.61 19.05,92.96 57.15,92.96 57.15,50.93 52.07,50.93 arc178 52.07,42.04 57.15,42.04 57.15,0 0,0
Copper layers (1+2*15+16): Top 0.0178mm / dielectric 12mil / Route2 0.0356mm / dielectric 28mil / Route15 0.0356mm / dielectric 12mil / Bottom 0.0178mm
Design rules "sunstone-4lyr_v1.0.0.3 *": minimum track width 4mil, minimum drill 8mil, track to track 4mil, track to pad 4mil, pad to pad 4mil, via to via 4mil, smd to smd 4mil, copper to edge 20mil, drill to drill 16mil, minimum pad ring 8mil, minimum via ring 8mil, stop-mask expansion 3mil, vias tented up to drill 50mil, thermal gap 8mil
Holes 3.17 mm at 5.08,87.88 52.07,87.88 5.08,5.08 52.07,5.08

### Footprints (pad centres in the part's own frame; a part is rotated, then mirrored left to right if it is on the bottom)
ANT3216A063R2400A = smd 0.6 x 1.8: S1 -1.325,0; S2 1.325,0
ANT1818B00BT1516S = smd 2.3 x 1.2: 0 0,-8.45 | smd 6.5 x 5: 1 -5.75,-6.55; 2 5.75,-6.55; 3 5.75,6.55; 4 -5.75,6.55
ELECTRON_SINGLE-ROW = drill 0.889 pad 1.753: 3V3 3.81,19.05; A0 31.75,1.27; A1 29.21,1.27; A2 26.67,1.27; A3 24.13,1.27; A4 21.59,1.27; A5 19.05,1.27; B0 46.99,1.27; B1 44.45,1.27; B2 41.91,1.27; B3 39.37,1.27; B4 36.83,1.27; B5 34.29,1.27; C0 46.99,19.05; C1 44.45,19.05; C2 41.91,19.05; C3 39.37,19.05; C4 36.83,19.05; C5 34.29,19.05; D0 31.75,19.05; D1 29.21,19.05; D2 26.67,19.05; D3 24.13,19.05; D4 21.59,19.05; D5 19.05,19.05; D6 16.51,19.05; D7 13.97,19.05; DAC 16.51,1.27; GND 11.43,19.05; GND@2 6.35,1.27; RST 6.35,19.05; RX 11.43,1.27; TX 8.89,1.27; VBAT 8.89,19.05; VIN 3.81,1.27; WKP 13.97,1.27
WRL-13678 = drill 1.016 octagon: 1 3.81,-1.27; 2 3.81,1.27; 3 1.27,-1.27; 4 1.27,1.27; 5 -1.27,-1.27; 6 -1.27,1.27; 7 -3.81,-1.27; 8 -3.81,1.27
BAL-NRF01D3 = smd 0.22 x 0.22: ANT1 -0.517,-0.25; ANT2 -0.517,0.25; GND 0.083,0.25; SE 0.516,0; VCC 0.083,-0.25
0402_CAP = smd 0.536 x 0.546: 1 -0.433,0; 2 0.433,0
0603_CAP = smd 0.7 x 1: 1 -0.65,0; 2 0.65,0
1206 = smd 1.6 x 1.8: 1 -1.4,0; 2 1.4,0
LED-0603 = smd 0.8 x 0.8: A 0,-0.75; C 0,0.75
DM3AT-SF-PEJM5 = smd 0.7 x 1.2: 1 3.2,-0.1; 2 2.1,-0.1; 3 1,-0.1; 4 -0.1,-0.1; 5 -1.2,-0.1; 6 -2.3,-0.1; 7 -3.4,-0.1; 8 -4.5,-0.1; B -5.45,-0.1 | smd 1 x 0.8: A -6.4,-10.6 | smd 1 x 1.2: MOUNT0 4.75,-0.1; MOUNT1 -6.4,-4.4 | smd 1 x 2.8: MOUNT2 -6.4,-14.75 | smd 1.3 x 1.9: MOUNT3 7.1,-15.2
TC2030-IDC-NL = smd 0.787 x 0.787: 1 -1.27,-0.635; 2 -1.27,0.635; 3 0,-0.635; 4 0,0.635; 5 1.27,-0.635; 6 1.27,0.635 | hole 1.016: -2.54,0; 2.54,1.016; 2.54,-1.016
MIC_AOM-4546P-R = drill 0.95: TERM+ 1.25,2; TERM- -1.25,2
0603-RES = smd 0.7 x 1: 1 -0.65,0; 2 0.65,0
0402_RES = smd 0.536 x 0.546: 1 -0.433,0; 2 0.433,0
B3U-1000P = smd 0.8 x 1.7: 1 -1.7,0; 2 1.7,0
PTS645 = smd 1.55 x 1.3: 1 -3.975,2.25; 2 3.975,2.25; 3 3.975,-2.25; 4 -3.975,-2.25
TESTPOINT_0.040IN = drill 1.016: TESTPOINT 0,0
LNA-TSLP-6-2-ALT = smd 0.45 x 0.25: 1 -0.3,0.4; 2 -0.3,0; 3 -0.3,-0.4; 4 0.3,-0.4; 5 0.3,0; 6 0.3,0.4
QCS5I = smd 0.35 x 0.425: 1 -0.5,0; 2 0,-0.287; 3 0.5,-0.287; 4 0.5,0.287; 5 0,0.287
ODFN-6-1.5MMX1.6MM = smd 0.8 x 0.25: 1 -0.6,0.5 | smd 0.65 x 0.25: 2 -0.675,0; 3 -0.675,-0.5; 4 0.675,-0.5; 5 0.675,0; 6 0.675,0.5
MAX-M8 = smd 1.8 x 0.7: 1 4.75,-4.4; 9 4.75,4.4; 10 -4.75,4.4; 18 -4.75,-4.4 | smd 1.8 x 0.8: 2 4.75,-3.3; 3 4.75,-2.2; 4 4.75,-1.1; 5 4.75,0; 6 4.75,1.1; 7 4.75,2.2; 8 4.75,3.3; 11 -4.75,3.3; 12 -4.75,2.2; 13 -4.75,1.1; 14 -4.75,0; 15 -4.75,-1.1; 16 -4.75,-2.2; 17 -4.75,-3.3
SOIC-8 = smd 0.61 x 2.21: 1 -1.905,-2.616; 2 -0.635,-2.616; 3 0.635,-2.616; 4 1.905,-2.616; 5 1.905,2.616; 6 0.635,2.616; 7 -0.635,2.616; 8 -1.905,2.616
QFN24_PAD = smd 0.5 x 0.25: 1 -1.55,1; 2 -1.55,0.6; 3 -1.55,0.2; 4 -1.55,-0.2; 5 -1.55,-0.6; 6 -1.55,-1; 13 1.55,-1; 14 1.55,-0.6; 15 1.55,-0.2; 16 1.55,0.2; 17 1.55,0.6; 18 1.55,1 | smd 0.08 x 0.13: 1$1 -1.32,1.06; 1$3 -1.26,0.94; P$33 1.26,-0.94; P$34 1.32,-1.06; P$58 1.26,0.94; P$59 1.32,1.06; P$68 -1.26,-0.94; P$69 -1.32,-1.06 | smd 0.1 x 0.185 rotated 45: 1$2 -1.25,1.024; P$49 1.024,-1.25 | smd 0.14 x 0.14: 1$4 -1.22,0.945; P$23 -0.945,-1.22; P$24 1.22,-0.945; P$36 0.945,1.22; P$51 0.945,-1.22; P$56 1.22,0.945; P$61 -0.945,1.22; P$66 -1.22,-0.945 | smd 0.05 x 0.05: 1$5 -1.175,0.97; P$25 -0.97,-1.175; P$31 1.175,-0.97; P$37 0.97,1.175; P$52 0.97,-1.175; P$57 1.175,0.97; P$62 -0.97,1.175; P$67 -1.175,-0.97 | smd 0.25 x 0.5: 7 -1,-1.55; 8 -0.6,-1.55; 9 -0.2,-1.55; 10 0.2,-1.55; 11 0.6,-1.55; 12 1,-1.55; 19 1,1.55; 20 0.6,1.55; 21 0.2,1.55; 22 -0.2,1.55; 23 -0.6,1.55; 24 -1,1.55 | smd 0.25 x 0.25: CENTER 0,0 | smd 0.4 x 0.4: DBBADFE -0.675,0.24 | smd 0.6 x 1.2: DBBADFE1 -0.575,-0.195 | smd 0.25 x 0.3: P$1 -0.2,1.3; P$3 0.2,1.3; P$5 0.6,1.3; P$11 -0.6,1.3; P$16 0.2,-1.3; P$18 -0.2,-1.3; P$20 -0.6,-1.3; P$26 0.6,-1.3 | smd 0.3 x 0.25: P$2 -1.3,0.2; P$4 -1.3,0.6; P$28 -1.3,-0.2; P$38 -1.3,-0.6; P$40 1.3,0.2; P$42 1.3,-0.2; P$44 1.3,-0.6; P$50 1.3,0.6 | smd 0.1 x 0.185 rotated 225: P$7 1.25,-1.024; P$60 -1.024,1.25 | smd 1.1 x 1.59: P$13 0.325,0 | smd 0.3 x 0.5 rotated 315: P$14 -0.592,0.512 | smd 0.5 x 1.59: P$15 -0.27,0 | smd 0.1 x 0.185 rotated 135: P$22 -1.024,-1.25; P$55 1.25,1.024 | smd 0.13 x 0.08: P$27 -0.94,-1.26; P$29 -1.06,-1.32; P$39 0.94,1.26; P$41 1.06,1.32; P$53 0.94,-1.26; P$54 1.06,-1.32; P$63 -0.94,1.26; P$64 -1.06,1.32 | smd 0.1 x 0.185 rotated 315: P$35 1.024,1.25; P$65 -1.25,-1.024
QFN-48-6MM = smd 0.8 x 0.203: 1 -3,2.2; 2 -3,1.8; 3 -3,1.4; 4 -3,1; 5 -3,0.6; 6 -3,0.2; 7 -3,-0.2; 8 -3,-0.6; 9 -3,-1; 10 -3,-1.4; 11 -3,-1.8; 12 -3,-2.2; 25 3,-2.2; 26 3,-1.8; 27 3,-1.4; 28 3,-1; 29 3,-0.6; 30 3,-0.2; 31 3,0.2; 32 3,0.6; 33 3,1; 34 3,1.4; 35 3,1.8; 36 3,2.2 | smd 0.203 x 0.8: 13 -2.2,-3; 14 -1.8,-3; 15 -1.4,-3; 16 -1,-3; 17 -0.6,-3; 18 -0.2,-3; 19 0.2,-3; 20 0.6,-3; 21 1,-3; 22 1.4,-3; 23 1.8,-3; 24 2.2,-3; 37 2.2,3; 38 1.8,3; 39 1.4,3; 40 1,3; 41 0.6,3; 42 0.2,3; 43 -0.2,3; 44 -0.6,3; 45 -1,3; 46 -1.4,3; 47 -1.8,3; 48 -2.2,3 | smd 4.6 x 4.6: GND 0,0
SOT23-5 = smd 0.6 x 1.2: 1 -0.95,-1.3; 2 0,-1.3; 3 0.95,-1.3; 4 0.95,1.3; 5 -0.95,1.3
TSOT23-6 = smd 0.6 x 0.927: 1 -0.95,-1.126; 2 0,-1.126; 3 0.95,-1.126; 4 0.95,1.126; 5 0,1.126; 6 -0.95,1.126
ABS05 = smd 0.5 x 1: A -0.55,0; B 0.55,0
TXC-8Y = smd 0.8 x 0.7: 1 -0.65,-0.5; 2 0.65,-0.5; 3 0.65,0.5; 4 -0.65,0.5

### Placement (x,y rotation side)
A1  1.52,10.41 270 bottom
A2  37.08,9.65 180 bottom
ASSY1  43.1,39.32 90 top
ASSY2  7.62,79.5 0 top
B1  8.15,11.53 0 bottom
C1  6.8,12.09 90 bottom
C2  47.5,22.61 180 top
C3  7.06,16.23 90 bottom
C4  10.69,17.22 90 bottom
C5  12.65,15.6 270 bottom
C6  14.68,15.72 270 bottom
C7  49.78,38.1 270 top
C8  8.09,13.84 0 bottom
C9  11.38,15.6 90 bottom
C10  7.66,10.47 0 bottom
C11  34.8,24.38 180 bottom
C12  37.59,42.16 180 bottom
C13  8.13,67.06 180 bottom
C14  8.69,9.27 270 bottom
C15  38.1,38.61 180 bottom
C16  16.16,7.87 270 bottom
C17  54.1,35.05 270 bottom
C18  6.1,66.04 270 bottom
C19  3.05,68.83 0 bottom
C20  42.93,30.99 180 top
C21  42.16,36.58 90 top
C22  19,12.93 90 bottom
C23  44.58,23.16 90 top
C24  40.13,30.48 270 top
C25  17.7,13.37 180 bottom
C26  5.84,40.13 180 top
C27  38.1,40.39 180 bottom
C28  51.82,26.67 180 top
D1  34.54,39.12 180 bottom
D2  17.7,17.4 0 bottom
D3  14.88,56.13 90 top
J1  8,38.1 0 top
J2  10.46,3.17 0 bottom
L1  37.08,20.07 270 bottom
L2  19,11.02 270 bottom
L3  17.73,11.28 90 bottom
L4  32,38.61 90 bottom
L5  33.27,38.61 90 bottom
MK1  52.07,22.23 0 bottom
R1  42.93,28.7 0 top
R2  13.46,5.34 180 bottom
R3  55.6,8.56 180 bottom
R4  35.05,42.16 180 bottom
R5  16.71,15.09 180 bottom
R6  14.99,54.1 0 top
R7  55.88,26.67 90 top
R8  42.42,39.12 0 bottom
R9  8.74,73.69 90 bottom
R10  6.96,73.63 90 bottom
R11  3.05,66.8 0 bottom
R12  8.64,40.89 90 top
R13  9.91,40.89 90 top
R14  3.3,40.13 180 top
R15  10.02,6.87 0 bottom
R16  1.52,40.13 90 top
R17  15.09,41.71 0 top
R18  37.59,47.75 0 bottom
R19  8.89,87.38 90 bottom
R20  21.59,8.64 270 bottom
R21  54.61,33.53 180 top
R22  41.66,26.16 180 top
R23  42.16,23.88 90 top
R24  37.11,31.93 0 top
R25  47.5,24.38 0 top
S1  16.1,3.17 90 bottom
S2  52.07,12.7 0 bottom
TP1  44.96,48.51 0 top
TP2  27.94,36.58 0 top
TP3  15.75,45.72 0 bottom
TP4  44.96,61.21 0 top
TP5  13.21,48.01 0 bottom
TP6  20.32,36.58 0 top
TP7  44.96,57.91 0 top
TP8  48.51,57.91 0 top
TP9  23.62,36.58 0 top
TP10  54.61,39.12 0 top
TP11  44.96,43.18 0 top
TP12  45.47,88.9 0 top
TP13  2.03,84.07 0 top
TP14  19.56,79.5 0 top
TP15  7.11,52.58 0 top
TP16  13.21,52.32 0 top
TP17  17.02,77.72 0 top
TP19  2.29,52.58 0 top
TP20  18.54,70.61 0 top
TP21  7.11,56.13 0 top
TP22  18.8,62.23 0 top
TP23  18.8,59.44 0 top
TP24  17.02,36.58 0 top
TP25  23.62,32.26 0 top
U1  37.08,21.79 270 bottom
U2  38.46,22.61 90 bottom
U3  52.07,34.92 0 bottom
U4  35.31,31.24 90 bottom
U5  46.99,34.29 270 top
U6  6.35,69.85 0 bottom
U7  12.65,11.13 0 bottom
U8  46.74,27.69 270 top
U9  7.62,84.33 0 bottom
U10  37.08,45.21 0 bottom
U11  18.8,8.38 180 bottom
U12  11.68,43.69 270 top
U13  54.36,30.99 0 top
U$3  [UCB_CAL_200MIL]  44.7,80.26 0 top
X1  13.72,17.42 180 bottom
X2  8.89,16.51 90 bottom

### Tracks (layer width: path | path; a pad name or v marks a point on that pad's centre or on a via)
!GPS_RESET  (via drill 0.3)
  Top 0.254: v39.37,40.89 37.34,40.89 25.91,52.32 25.91,59.05 ASSY1.D4
  Bottom 0.254: v39.37,40.89 39.71,40.56 U4.9 | TP23.TESTPOINT 22.58,59.44 ASSY1.D4
!IMU_INT
  Bottom 0.254: U6.12 4.98,68.3 R11.1 3.48,65.86 5.08,64.26 7.11,64.26 | 7.11,64.26 22.33,64.26 ASSY1.D2 | TP21.TESTPOINT 7.11,64.26
!LIGHT_INT  (via drill 0.3)
  Top 0.254: ASSY1.A1 43.18,67.18 43.18,57.91 | v44.7,40.39 43.18,41.91 43.18,57.91 | TP7.TESTPOINT 43.18,57.91
  Bottom 0.254: U3.4 50.66,34.42 v44.7,40.39 43.43,39.12 R8.1
!SAFEMODE
  Bottom 0.254: R3.2 56.05,8.57 S2.4 | S2.3 S2.4 | S2.4 54.61,11.88 54.61,26.42 55.88,27.69 55.88,35.31 46.99,44.2 46.99,57.91 | ASSY1.A0 46.99,65.91 46.99,57.91 | TP8.TESTPOINT 46.99,57.91
!SD_CS  (via drill 0.3)
  Top 0.254: J1.2 10.16,38.06 10.16,40.21 R13.1 10.09,40.64 20.32,40.64 | 20.32,40.64 26.42,40.64 v30.99,45.21 | TP6.TESTPOINT 20.32,40.64
  Bottom 0.254: v30.99,45.21 37.85,52.07 42.42,52.07 43.18,52.83 43.18,64.64 ASSY1.A2
!SD_DETECT  (via drill 0.3)
  Top 0.254: J1.A 0.76,28.34 0.76,38.94 R16.1 v1.52,38.86 | v14.22,44.45 14.22,46 ASSY1.D6
  Bottom 0.254: v1.52,38.86 2.03,38.35 8.89,38.35 11.43,40.89 11.43,42.42 13.46,44.45 v14.22,44.45 17.02,41.66 TP24.TESTPOINT
!WIFI_RESET
  Bottom 0.254: ASSY1.C4 14.48,76.15 | TP17.TESTPOINT 14.48,76.15 | ASSY2.6 7.62,79.5 7.62,77.47 8.94,76.15 14.48,76.15
-AMP
  Top 0.254: 48.15,26.62 U8.4
  Top 0.813: C2.1 R25.2 48.15,26.62 | U8.4 50.35,26.74 C28.2
A_MIC_OUT
  Top 0.813: R24.2 40.08,31.93 | 40.08,31.93 C24.1 | U5.2 43.08,34.92 40.08,31.93
ANT
  Bottom 0.32: A2.0 L1.2
AUDIO_OUT  (via drill 0.3)
  Top 0.406: U5.5 47.12,32.38 v46.74,32.77
  Route2 0.254: TP11.TESTPOINT 46.74,43.18
  Route2 0.406: v46.74,32.77 46.74,43.18 46.74,63.25 42.67,67.31 41.15,67.31 40.39,68.07 40.39,79.78 ASSY1.B2
AUDIO_PWR_EN
  Top 0.254: ASSY1.B4 46.99,70.99 46.99,44.2 53.34,37.85 | 53.34,37.85 55.88,35.31 55.88,33.96 55.54,33.62 | TP10.TESTPOINT 53.34,37.85 | 55.54,33.62 55.45,33.53 R21.1 | 55.54,33.62 56.39,32.77 56.39,29.97 56.13,29.72 55.45,29.72 U13.3
AVDD1  (via drill 0.2)
  Top 0.406: v9.88,14.12 10.29,13.72 14.99,13.72 15.75,14.48 17.96,14.48 v19.89,12.55
  Bottom 0.203: U7.35 9.17,12.93 9.09,13.03 9.09,13.23 9.19,13.33 U7.36 9.65,13.89 v9.88,14.12 9.83,14.18 8.88,14.18 C8.1 | L2.1 C22.1 19.84,12.5 v19.89,12.55
BLE_PWR_EN  (via drill 0.3)
  Top 0.254: v20.83,12.19 20.83,25.65 28.57,33.4 | 28.57,33.4 32.77,37.59 43.18,37.59 46.48,40.89 46.48,68.96 ASSY1.B5 | TP9.TESTPOINT 25.4,36.58 28.57,33.4
  Bottom 0.254: R20.1 21.59,9.4 21.34,9.65 19.89,9.65 U11.3 19.75,11.11 v20.83,12.19
BLE_RXD  (via drill 0.3)
  Route2 0.254: ASSY1.C3 10.67,65.3 10.67,52.32 | v9.65,7.87 10.41,8.64 10.41,13.21 10.67,13.46 10.67,52.32 | TP16.TESTPOINT 10.67,52.32
  Bottom 0.203: U7.25 v9.65,7.88 v9.65,7.87
BLE_TXD  (via drill 0.3)
  Route2 0.254: ASSY1.C2 10.16,67.33 10.16,52.58 | 10.16,52.58 10.16,15.49 9.14,14.48 9.14,13.72 9.91,12.95 9.91,9.14 8.89,8.13 8.89,7.62 9.65,6.86 v11.68,6.86 v11.69,6.86 | TP15.TESTPOINT 10.16,52.58
  Bottom 0.203: U7.22 11.25,7.55 11.28,7.52 11.69,7.11 v11.69,6.86
DCC1
  Bottom 0.203: U7.2 16.33,12.93 17.09,12.17 17.67,12.17 L3.2
GND  (via drill 0.2, 0.3)
  Top 0.254: U12.4 13.65,42.74 13.78,42.61
  Top 0.305: 13.78,42.61 v13.97,42.42
  Top 0.508: J1.MOUNT0 12.75,39.17 v13.21,39.62
  Top 0.813: 10.67,35.05 12.75,37.13 J1.MOUNT0 12.75,38.3 | J1.MOUNT3 13.36,24.64 10.67,24.64
  Bottom 0.203: C16.2 16.13,7.37 15.75,7.75 15.23,7.75 U7.13 14.85,8.8 v14.17,9.6 | 8.08,12.53 8.09,12.53 U7.34 10.88,12.53 v11.12,12.65 10.48,12.13 U7.33 | v14.17,11.63 v14.17,12.65 | U7.GND v13.16,11.63
  Bottom 0.254: v5.84,70.36 U6.CENTER
  Bottom 0.305: B1.GND 8.08,12.53
  Bottom 0.406: ASSY1.GND 27.13,50.75 27.18,50.8
  Bottom 0.508: v13.21,39.62 13.97,40.39 v13.97,42.42
  Bottom 0.813: v27.18,91.69 18.03,82.55 13.97,82.55 v10.41,86.11
  other vias: 12.14,11.63 12.14,10.62 12.14,9.6 12.14,12.65 11.13,11.63 11.13,10.62 11.13,9.6 13.16,9.6 13.16,10.62 13.16,12.65 14.17,10.62 38.1,24.38 38.1,25.15 37.39,23.11 37.34,23.88 36.58,24.13 36.07,24.89 36.07,22.61 35.31,23.37 35.31,21.34 39.37,25.15 39.37,24.38 39.37,23.62 39.62,22.86 39.62,22.1 39.12,21.34 38.35,21.34 37.85,20.83 37.85,20.07 37.85,19.3 36.32,19.3 36.32,20.07 36.32,20.83 33.53,24.38 33.78,22.35 22.1,1.27 22.1,3.81 1.27,13.97 2.54,13.97 3.81,13.97 5.08,13.97 6.35,13.97 1.27,7.37 2.54,7.37 3.81,7.37 5.08,7.62 6.35,7.37 6.6,8.64 6.6,9.91 46.99,1.27 46.99,3.81 46.99,6.35 46.99,8.89 46.99,11.43 46.99,13.97 46.99,16.51 46.99,19.05 44.45,19.3 41.91,19.3 39.37,19.3 34.8,19.3 32.26,19.3 29.72,19.3 27.18,19.05 39.37,6.35 39.37,8.89 39.37,11.43 38.61,13.97 38.61,3.81 35.56,3.81 35.56,1.27 38.61,1.27 37.08,1.27 37.08,3.81 37.08,6.35 37.08,8.89 37.08,11.43 37.08,13.97 34.8,6.35 34.8,8.89 34.8,11.43 35.56,13.97 32.26,6.35 32.26,8.89 32.26,11.43 29.72,6.35 29.72,8.89 29.72,11.43 41.91,6.35 41.91,8.89 41.91,11.43 44.45,6.35 44.45,8.89 44.45,11.43 27.18,1.27 27.18,3.81 27.18,6.35 27.18,8.89 27.18,11.43 27.18,13.97 27.18,16.51 24.64,1.27 24.64,3.81 24.64,6.35 24.64,8.89 24.64,11.43 24.64,13.97 10.41,87.12 10.41,85.09 7.87,65.28 5.33,72.14 6.86,70.36 6.86,69.34 5.84,69.34 42.16,32.26 43.69,27.18 5.59,39.12 36.07,38.61 54.36,30.99 52.83,33.27 14.73,7.11 8.89,19.3 19.81,14.48 19.56,3.81 19.56,1.27 6.35,1.27 3.81,1.27 1.27,1.27 1.27,3.81 1.27,6.35 3.05,3.05 7.37,6.35 7.37,7.62 1.27,16.51 3.81,16.51 6.1,16.51 1.27,19.05 3.81,19.05 6.35,19.05 8.89,21.34 43.94,70.1 44.7,69.34 45.47,68.58 43.94,67.82 44.7,67.06 45.47,66.29 46.48,72.64 45.72,73.41 43.94,75.18 44.2,72.64 44.96,71.88 45.72,71.12 49.53,1.27 49.53,3.81 49.53,6.35 49.53,8.89 52.07,8.89 54.61,1.27 54.61,3.81 54.61,6.35 52.07,19.05 52.07,16.51 52.07,21.59 49.53,13.97 49.53,11.43 52.07,13.97 52.07,11.43 55.63,12.7 55.63,19.05 55.63,16.51 55.63,21.59 27.18,21.59 29.72,21.59 32.26,21.59 32.26,24.13 29.72,24.13 27.18,24.13 27.18,26.67 29.72,26.67 29.72,29.21 27.18,29.21 32.26,29.21 34.8,29.21 37.34,29.21 34.8,31.75 32.26,31.75 32.26,34.29 34.8,34.29 37.34,34.29 41.91,21.59 49.53,19.05 48.26,17.78 49.53,21.59 29.72,31.75 28.7,34.54 26.92,33.78 43.94,64.77 44.7,64.01 45.47,63.25 2.79,65.02 22.35,13.97
  pour Top (rank 2): 57.15,-3.05 0,-3.05 0,92.96 57.15,92.96
  pour Route2 (rank 2): 57.15,-2.03 0,-2.03 0,92.96 57.15,92.96
  pour Bottom (rank 3): 57.15,0 0,0 0,92.96 57.15,92.96
  pour Bottom (rank 2, no thermals): 2.29,7.37 2.29,9.4 0.76,9.4 0.76,7.37
GND2  (via drill 0.3)
  other vias: 52.07,1.27
GPS_PWR_EN  (via drill 0.3)
  Top 0.254: v37.08,49.02 37.08,50.42 ASSY1.D3 20.02,63.45 TP22.TESTPOINT
  Bottom 0.254: v37.08,49.02 38.02,48.08 R18.1 38.61,47.75 39.12,47.24 39.12,45.97 38.35,45.21 36.32,45.21 36.13,45.02 U10.3
GPS_RF_IN
  Bottom 0.32: U2.4 38.74,26.36 U4.11
GPS_RXD
  Bottom 0.254: L5.2 33.27,46.48 36.58,49.78 40.26,49.78 ASSY1.TX 44.65,48.21 TP1.TESTPOINT
GPS_TXD
  Bottom 0.254: ASSY1.RX 37.03,50.75 32,45.72 32,39.12 | L4.2 32,39.12 | TP2.TESTPOINT 30.48,39.12 32,39.12
GPS_VCC
  Bottom 0.254: R4.2 36.25,42.93 38.02,42.93 | 37.51,36.32 U4.7 | U4.8 38.53,36.06 | 38.02,44.08 U10.1 U10.2
  Bottom 0.406: 36.83,37.34 37.59,37.34 | 37.59,37.34 38.35,37.34 | 38.35,37.34 38.61,37.08 | 37.59,37.34 37.51,37.25 | 38.35,37.34 38.53,37.52 C15.2 | U4.6 36.41,36.91
  Bottom 0.61: 38.53,36.06 C15.2 C27.2 38.53,41.66 C12.2 38.02,42.93 38.02,44.08 | 38.35,37.34 36.83,37.34 36.41,36.91 | 37.51,37.25 37.51,36.32
LED
  Top 0.254: ASSY1.C5 14.13,63.69 D3.C
LNA_IN
  Bottom 0.254: 37.08,21.13 U1.5
  Bottom 0.32: L1.1 37.08,21.13
LNA_OUT
  Bottom 0.254: 37.59,22.09 U1.3
  Bottom 0.305: U2.1 38.44,22.09
  Bottom 0.32: 38.44,22.09 37.59,22.09
N$1
  Bottom 0.254: D1.A 34.54,42.09 R4.1
N$2
  Bottom 0.254: U4.4 34.21,38.03 D1.C
N$3
  Top 0.254: D3.A 15.42,55.92 R6.2
N$4
  Top 0.813: MK1.TERM+ 53.22,26.62 C28.1 53.87,26.02 R7.1
N$5
  Top 0.254: 46.85,27.83 46.85,27.69
  Top 0.406: 46.85,27.83 46.04,28.64 U8.1 45.37,28.7 R1.2 | 46.85,27.69 R25.1
  Top 0.813: C2.2 R25.1
N$6
  Top 0.406: C7.2 49.78,36.37 U5.8
N$7
  Top 0.406: R1.1 40.51,28.7 C24.2
N$8  (via drill 0.3)
  other vias: 6.35,21.34
N$9
  Top 0.813: U8.3 44.58,25.88 C23.2 42.2,24.57 R23.2 42.31,24.67 R22.1
N$10
  Bottom 0.203: B1.ANT1 8.74,11.33 U7.31
N$11
  Top 0.406: U5.6 47.62,33.66 45.09,36.2 U5.1 42.22,36.2 C21.1
N$12
  Bottom 0.203: B1.ANT2 8.74,11.73 U7.32
N$13
  Bottom 0.254: C1.1 6.81,11.78
  Bottom 0.305: C1.1 6.6,11.78 1.52,11.78 A1.S1
  Bottom 0.32: B1.SE 6.86,11.53 6.6,11.78
N$14
  Bottom 0.254: ASSY2.8 4.83,81.79 7.62,81.79 | ASSY2.4 7.87,81.79 7.62,81.79 | U9.1 U9.2 7.62,81.79
N$15
  Bottom 0.203: L3.1 18.96,10.63 L2.2
N$16  (via drill 0.3)
  other vias: 3.81,21.34
N$17  (via drill 0.3)
  other vias: 1.27,21.34
N$18
  Top 0.254: R16.2 1.6,40.64
  Top 0.406: R12.2 8.64,42.23 10.1,43.69 U12.2 U12.1 | R13.2 R12.2 | R12.2 7.87,41.33 | 7.87,41.33 7.47,41.33 7.29,41.15 | 7.29,41.15 C26.1 | R14.2 2.87,40.72 | 2.87,40.72 3.3,41.15 7.29,41.15 | R16.2 2.72,40.56 2.87,40.72 | J1.4 7.87,38.03 7.87,41.33
N$20
  Bottom 0.203: U7.37 10.45,14.49 10.24,14.71 8.71,14.71 8.33,15.09 8.33,15.8 X2.1 8.33,15.8 C3.1
N$21
  Bottom 0.203: X2.3 9.99,16.79 C4.1 10.85,16.63 10.62,16.4 10.62,14.83 10.85,14.6 U7.38
N$22
  Bottom 0.203: C9.1 11.25,14.99 11.25,14.73 U7.39
N$24
  Bottom 0.203: U7.29 9.21,10.53 8.69,10.01 C14.1
N$25
  Bottom 0.203: D2.A 17.7,15.64 R5.2
N$26
  Bottom 0.203: S1.2 14.36,4.88 R2.2
N$33
  cutout Bottom: 26.16,92.96 11.18,92.96 11.18,18.8 16.76,18.8 16.76,15.24 26.16,15.24
  cutout Route15: 26.16,92.96 11.18,92.96 11.18,15.24 26.16,15.24 26.16,41.66 22.86,41.66 22.86,44.45 26.16,44.45
  cutout Route2: 26.16,92.96 11.18,92.96 11.18,15.24 26.16,15.24
  cutout Top: 26.16,92.96 11.18,92.96 11.18,15.24 26.16,15.24
N$34
  cutout Bottom: 6.1,10.67 9.91,10.67 9.91,12.45 6.1,12.45 6.1,13.21 0,13.21 0,8.13 0.76,8.13 0.76,9.4 2.29,9.4 2.29,8.13 6.1,8.13
N$37
  cutout Top: 0,13.21 6.1,13.21 6.1,8.13 0,8.13
N$40
  Bottom 0.254: U4.2 L4.1
N$41
  Bottom 0.254: L5.1 33.27,36.16 U4.3
NRF_A2
  Bottom 0.203: 14.24,17.32 X1.B | X1.B 14.05,17.21 U7.46 | X1.B 14.68,17.14 C6.1
NRF_A3
  Bottom 0.203: U7.45 13.65,16.94 X1.A 12.65,17.04 C5.1
NRF_P29
  Bottom 0.203: U7.48 15.7,14.98 15.7,16.48 17.36,18.15 D2.C
NRF_SWDCLK
  Bottom 0.203: U7.24 10.45,7.56 R15.1 10.45,4.2 J2.4
NRF_SWDIO/!RESET
  Bottom 0.203: J2.2 10.97,4.95 10.97,5.31 | 10.97,5.31 10.97,7.4 10.85,7.52 U7.23 | R2.1 11.01,5.34 10.97,5.31
  Bottom 0.254: R2.1 13.03,5.66 13.21,5.84 21.84,5.84 23.62,7.62 23.62,10.67 21.59,12.7 21.59,32.26 | 21.59,32.26 21.59,50.83 ASSY1.D7 | 21.59,32.26 TP25.TESTPOINT
REGOUT
  Bottom 0.254: C18.1 6.17,66.47 6.15,66.49 U6.10
SD_ENABLE_POWER
  Top 0.305: R17.1 14.53,41.71 14.22,41.66 10.92,41.66 10.67,41.91 10.67,42.63 U12.3
SD_MISO  (via drill 0.3)
  Top 0.254: J1.7 4.57,38.03 v4.57,39.12 4.57,39.3 R14.1
  Route2 0.254: ASSY1.A4 42.14,61.21 TP4.TESTPOINT
  Bottom 0.254: v4.57,39.12 5.33,39.88 5.84,39.88 6.43,39.29 7.8,39.29 8.13,39.62 8.13,40.64 22.86,55.37 22.86,56.64 23.37,57.15 38.08,57.15 ASSY1.A4
SD_MOSI  (via drill 0.3)
  Top 0.254: R12.1 8.89,40.21 v8.89,39.37 8.89,38.11 J1.3
  Bottom 0.254: v8.89,39.37 10.16,40.64 10.16,42.16 14.73,46.74 | ASSY1.A5 38.08,54.61 22.61,54.61 14.73,46.74 | TP3.TESTPOINT 14.73,46.74
SD_SCLK  (via drill 0.3)
  Top 0.254: J1.5 6.8,39.57 v7.11,39.88
  Bottom 0.254: ASSY1.A3 38.08,59.69 23.37,59.69 22.35,58.67 22.35,55.37 14.1,47.11 | v7.11,39.88 7.11,40.13 14.1,47.11 | TP5.TESTPOINT 14.1,47.11
SENSORS_SCL  (via drill 0.3)
  Top 0.254: v39.12,42.42 39.12,53.47 ASSY1.D1 | v7.87,73.41 8.13,73.41 v9.14,72.39
  Bottom 0.254: U6.23 R10.1 7.67,73.2 v7.87,73.41 | v9.14,72.39 18.54,72.39 | 18.54,72.39 20.19,72.39 ASSY1.D1 | U3.5 51.25,35.07 50.98,35.07 44.9,41.15 40.39,41.15 v39.12,42.42 | TP20.TESTPOINT 18.54,72.39
SENSORS_SDA  (via drill 0.3)
  Top 0.254: v40.13,42.42 40.13,54.99 ASSY1.D0
  Bottom 0.254: U6.24 7.35,71.86 R9.1 | R9.1 8.89,73.41 | ASSY1.D0 21.87,73.25 10.67,73.25 | 10.67,73.25 R9.1 | U3.6 45.16,41.66 40.89,41.66 v40.13,42.42 | 10.67,73.25 10.67,74.17 9.91,74.93 5.59,74.93 1.02,70.36 1.02,53.85 TP19.TESTPOINT
VCC  (via drill 0.3)
  Top 0.254: R6.1 14.3,54.36 v8.38,54.36 | v53.59,36.32 54.18,35.74 R21.2 53.41,32.76 U13.6 U13.5 | 14.61,43.56 14.48,43.69 U12.5 U12.6
  Top 0.305: 14.61,43.56 15.52,42.65 R17.2
  Top 0.508: R17.2 22.63,41.71 ASSY1.3V3
  Route15 0.762: v7.62,86.61 7.62,85.09 8.64,84.07 10.41,84.07
  Route15 0.813: 27.18,89.92 25.4,89.92 18.03,82.55 13.97,82.55 12.45,84.07 10.41,84.07
  Bottom 0.254: 52.83,35.42 U3.1 54.04,35.42 C17.1 54.1,35.81 v53.59,36.32 | U6.13 3.5,68.85 C19.1 3.48,68.25 2.62,67.39 R11.2 | U6.8 6.95,67.8 C13.1 7.7,66.47 v7.87,66.29 | U6.22 6.55,71.94 5.21,73.28 | U6.1 8.64,71.59 v8.64,71.63 | R3.1 55.09,8.64 v54.1,8.64 | R8.2 41.68,39.12 40.92,39.88 v40.89,39.88 | U9.6 U9.5 v7.62,86.61 7.62,87.38 8.05,87.81 R19.2 | U10.6 U10.5 37.08,47.75 | R20.2 18.87,8.2 18.8,8.13 U11.5 U11.6
  Bottom 0.406: 3.5,68.85 3.5,71.57 v4.06,72.14 5.21,73.28 6,74.07 R10.2 7.01,74.12 R9.2 | R18.2 37.08,47.75 v36.07,47.75
  Bottom 0.508: R20.2 22.17,8.2 22.61,8.64 22.61,10.16 v22.1,10.67
  pour Route15 (rank 2): 57.15,-1.02 0,-1.02 0,92.96 57.15,92.96
VCC_A_MIC
  Top 0.254: 54.75,28.45 54.36,28.84 U13.2 U13.1
  Top 0.406: C20.1 43.36,30.66 42.93,30.23 41.4,30.23 41.15,30.48 39.12,30.48 38.61,29.97 38.61,27.69 40.13,26.16 R22.2
  Top 0.813: C20.1 44.45,30.99 | 44.45,30.99 48.01,30.99 | 49.51,30.99 48.01,30.99 | U5.7 50.8,34.92 51.56,34.16 51.56,31.01 49.51,30.99 | U8.5 48.04,30.96 48.01,30.99 | U5.4 44.37,31.06 44.45,30.99 | R7.2 54.75,28.45 50.8,28.45 49.51,29.74 49.51,30.99
VCC_BLE  (via drill 0.3)
  Top 0.406: v16.51,13.72 v16.51,9.14 16.51,4.83 v12.95,1.27
  Bottom 0.203: 15.76,8.93 U7.12 15.78,8.93 16.16,8.55 16.16,8.38 C16.1 | 17.1,13.33 C25.1
  Bottom 0.254: U7.1 16.13,13.33 v16.51,13.72 16.28,13.95 R5.1 | v16.51,9.14 16.76,9.14 17.02,9.4 17.74,9.4 U11.1 U11.2
  Bottom 0.406: v16.51,9.14 16.51,8.73 16.16,8.38 | C25.1 16.93,13.72 v16.51,13.72 | v12.95,1.27 11.73,2.49 J2.1
VCC_RF
  Bottom 0.203: U1.2 37.08,22.61 35.31,24.38 C11.2 | U1.6 36.59,21.59 36.58,21.59
  Bottom 0.254: C11.2 35.31,24.46
  Bottom 0.32: 35.31,24.46 U4.14 | 36.58,21.59 36.07,21.59 34.54,23.11 34.54,23.62 35.23,24.31 C11.2
VDD_PA1
  Bottom 0.203: U7.30 9,10.93 8.54,10.47 C10.1 8.09,11.27 B1.VCC
WIFI_PWR_EN
  Bottom 0.254: TP12.TESTPOINT 45.47,87.4 ASSY1.B1 40.62,82.55 22.86,82.55 22.1,81.79 12.89,81.79 10.64,84.04 10.35,84.33 | 10.35,84.33 9.4,85.28 9.4,86.11 8.81,86.69 R19.1 | 10.35,84.33 5.59,84.33 5.33,84.07 5.33,83.57 5.7,83.2 U9.3
WIFI_RXD
  Top 0.254: ASSY1.C1 19.79,79.5 TP14.TESTPOINT 5.08,79.5 ASSY2.7
WIFI_TXD
  Top 0.254: TP13.TESTPOINT 8.13,84.07 ASSY2.2 18.52,80.77 ASSY1.C0

### Text on the board
tNames: WIFI_PWR_EN | WIFI_TXD | WIFI_RXD | !WIFI_RESET | Noah Klugman / Branden Ghena / Neal Jackson / 01/18 | SENSORS_SCL | GPS_PWR_EN | SD_MISO | !GPS_RESET | !SAFEMODE | !IMU_INT | SENSE_SDA | BLE_TXD | BLE_RXD | !LIGHT_INT | GPS_RXD | SD_SCLK | SD_MOSI | AUDIO_OUT | !SD_CS | GPS_TXD | AUDIO_PWR_EN | BLE_PWR_EN | SD_DETECT | NRF_SWDIO/!RESET
bNames: RESET
Document: Antenna Entry / (from below) | Cell Antenna below / (No solid groundplane) | Wire Entry (above board)